# Altium project CPU_v1.PrjPCB (part 1 of 2)
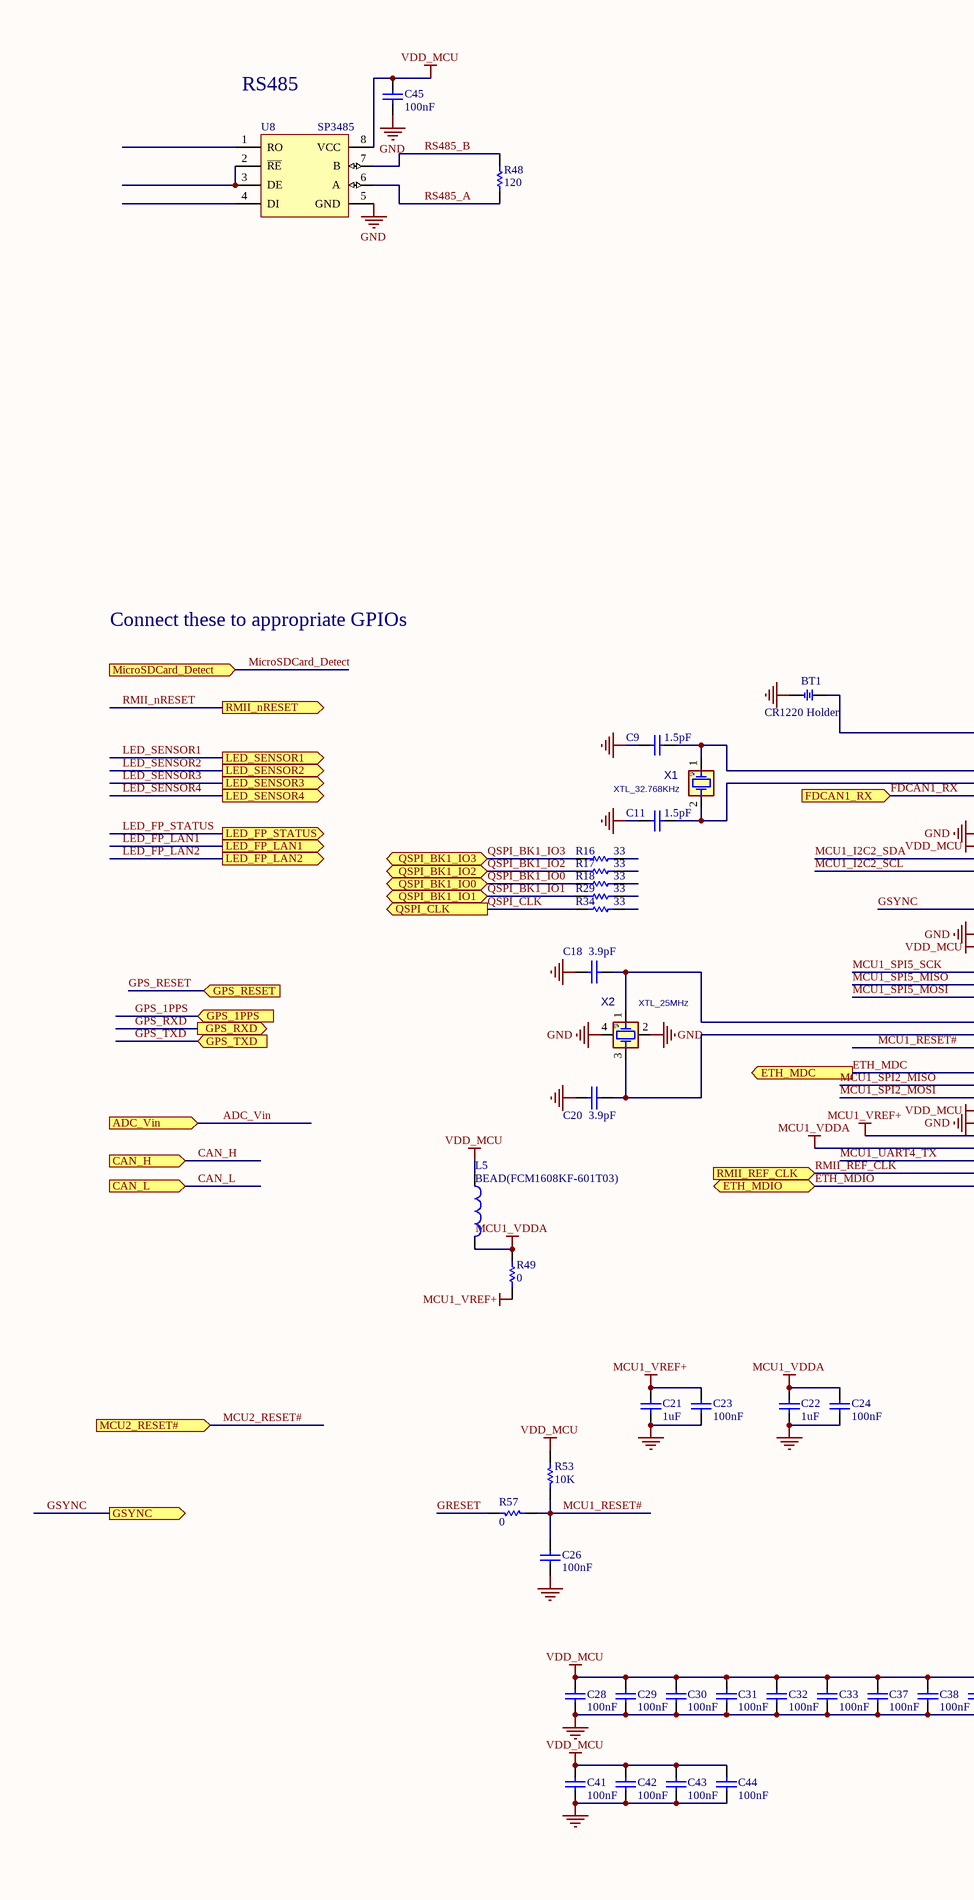
[diagram p0: MCU176_1.SchDoc, left]
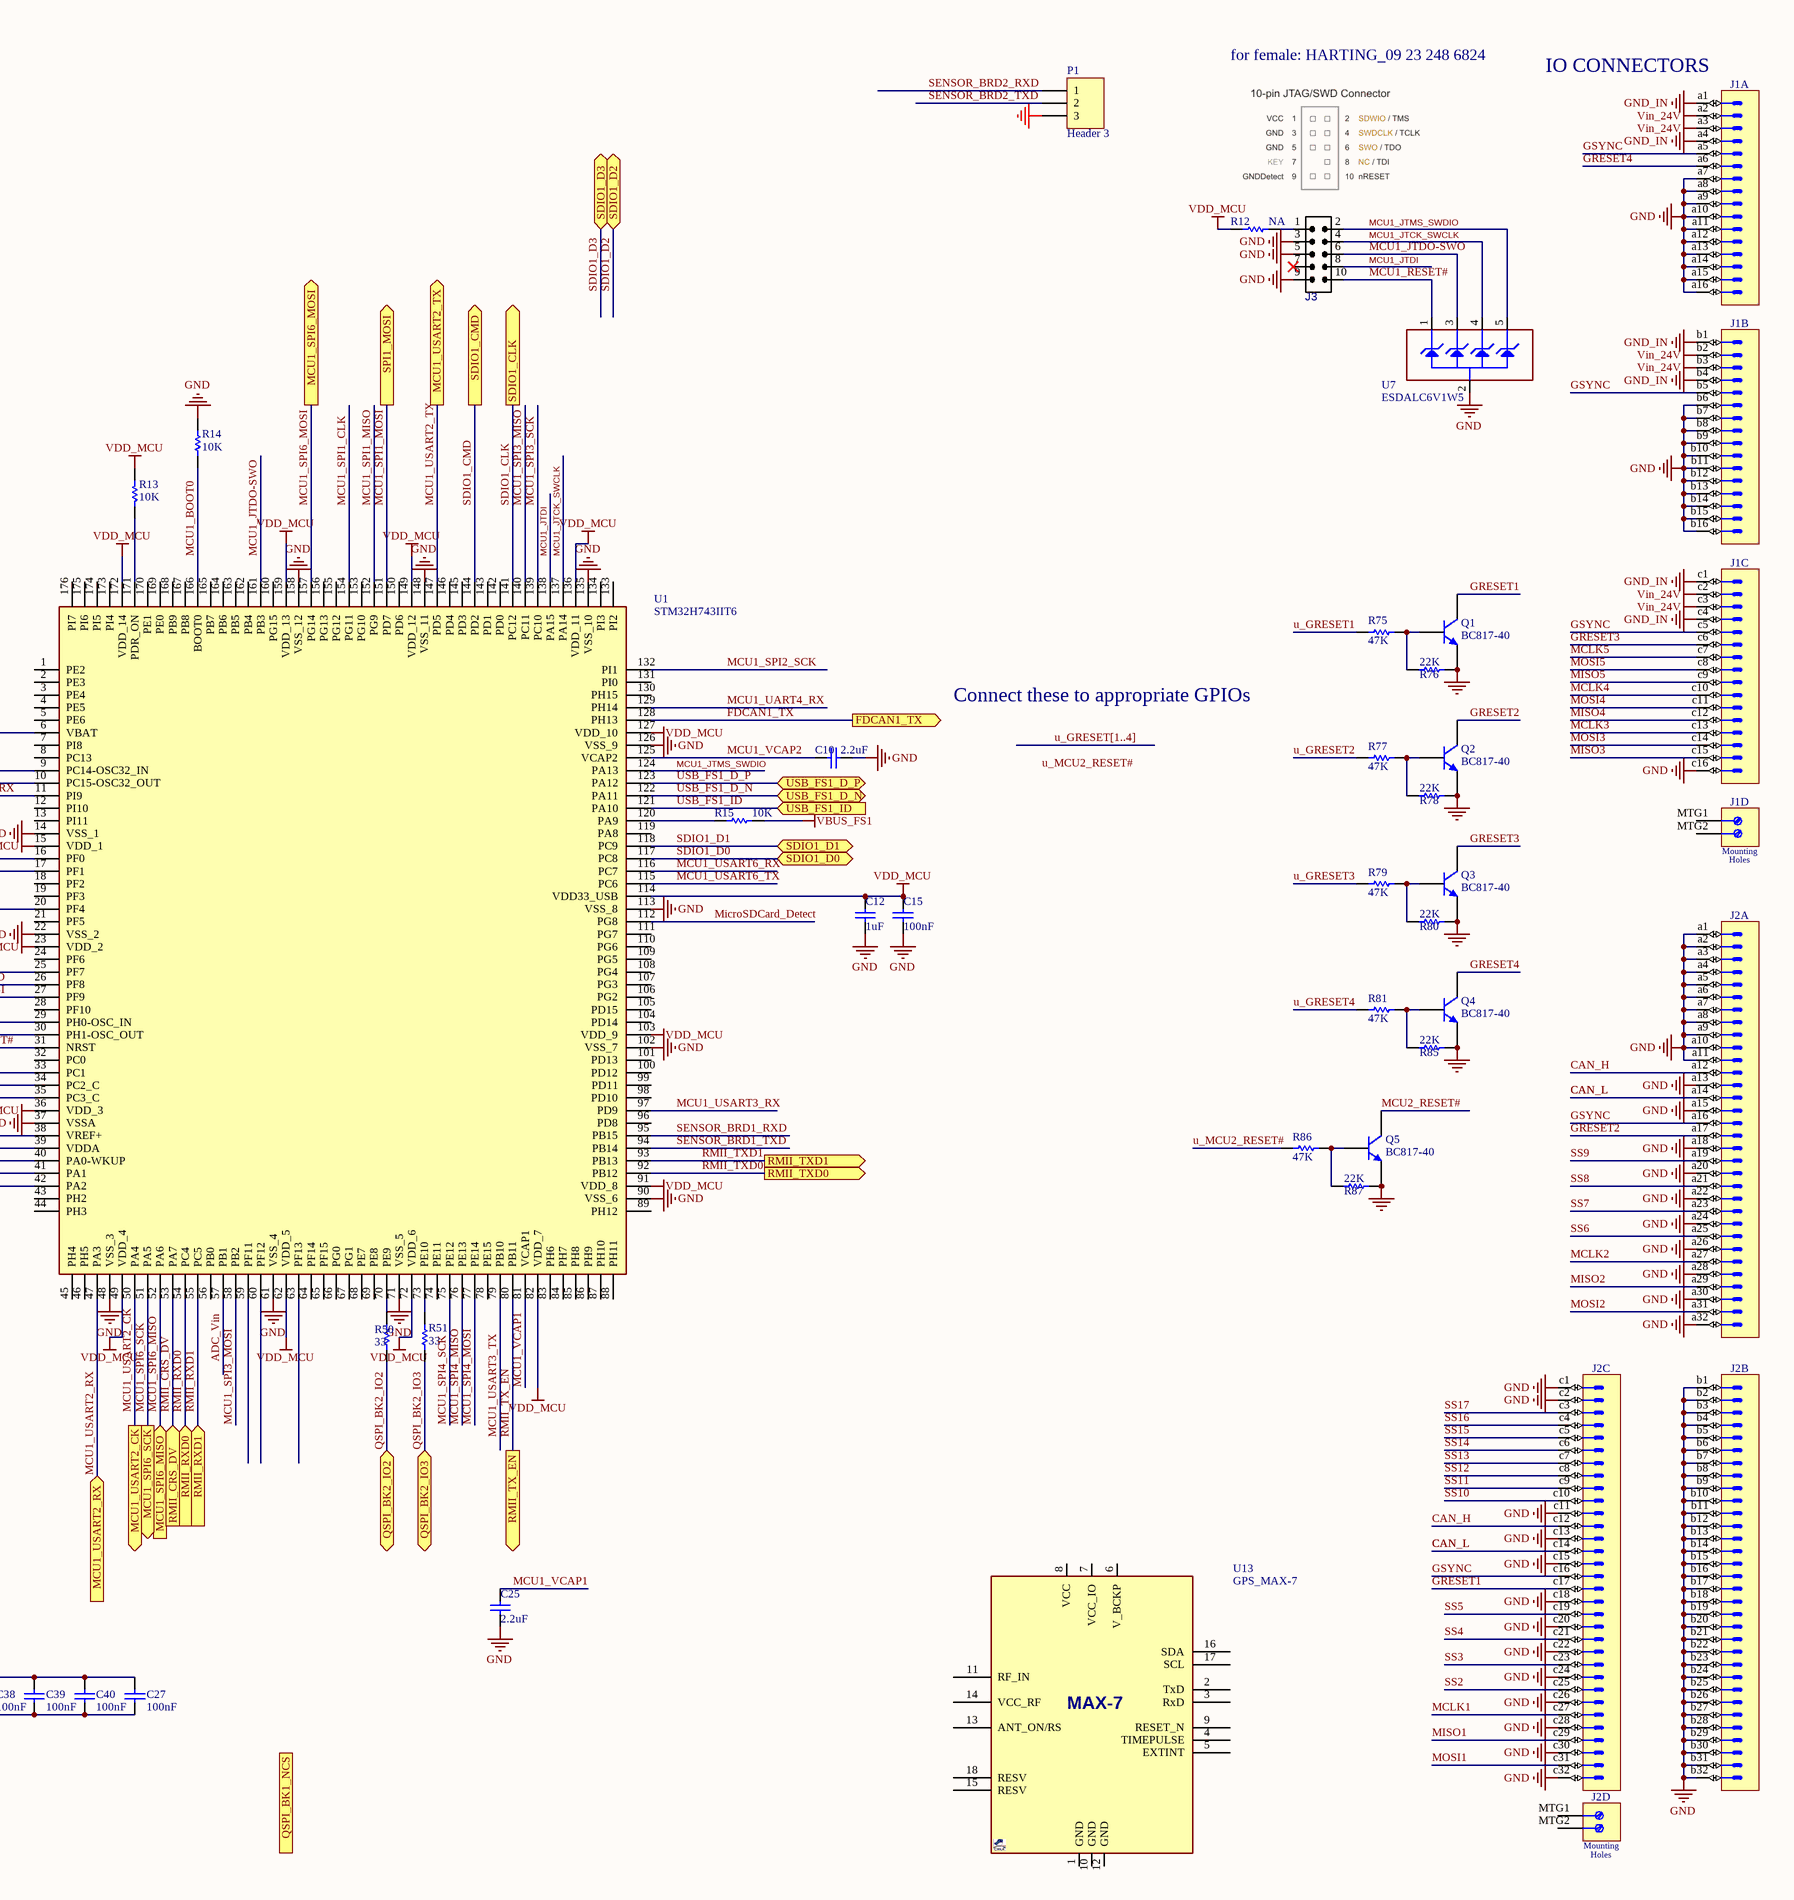
[diagram p1: MCU176_1.SchDoc, right]
11 sheets, 303 parts. Net scope: flat (ports and power ports of the same name join across sheets).
Board file: CPU_v1.PcbDoc
Sheets:
  MCU176_1.SchDoc
  MCU176_2.SchDoc
  Power.SchDoc
  Ethernet.SchDoc
  FDCAN&QSPI.SchDoc
  SD card.SchDoc
  USB_OTG_FS.SchDoc
  MCU2_USB.SchDoc
  GPS.SchDoc
  LCDTFT_FPC45P_RGB.SchDoc
  OpticDiodes+LEDs.SchDoc

## Sheet MCU176_1.SchDoc
size A2

### Parts
(Parts that share a designator on the sheet are numbered #1, #2 ... from top to bottom, then left to right.)
BT1  CR1220 Holder  [BTH1220]
C9  1.5pF  [C0603E]
C10  2.2uF  [C0603E]
C11  1.5pF  [C0603E]
C12  1uF  [C0603E]
C15  100nF  [C0603E]
C18  3.9pF  [C0603E]
C20  3.9pF  [C0603E]
C21  1uF  [C0603E]
C22  1uF  [C0603E]
C23  100nF  [C0603E]
C24  100nF  [C0603E]
C25  2.2uF  [C0603E]
C26  100nF  [C0603E]
C27  100nF  [C0603E]
C28  100nF  [C0603E]
C29  100nF  [C0603E]
C30  100nF  [C0603E]
C31  100nF  [C0603E]
C32  100nF  [C0603E]
C33  100nF  [C0603E]
C37  100nF  [C0603E]
C38  100nF  [C0603E]
C39  100nF  [C0603E]
C40  100nF  [C0603E]
C41  100nF  [C0603E]
C42  100nF  [C0603E]
C43  100nF  [C0603E]
C44  100nF  [C0603E]
C45  100nF  [C0603E]
J1#1  DIN 41612 Type 2C  [HARTING_09 23 148 6921]  (value not drawn)  (parts A,B,C,D of 4)
J2  DIN 41612 Type C  [HARTING_09 03 696 6921]  (value not drawn)  (parts A,B,C,D of 4)
J3  IDC_2X5  [IDC_2X5]  (value not drawn)
L5  BEAD(FCM1608KF-601T03)  [L0603E]
P1  Header 3  [xh-3]
Q1  BC817-40  [SOT-23-3]
Q2  BC817-40  [SOT-23-3]
Q3  BC817-40  [SOT-23-3]
Q4  BC817-40  [SOT-23-3]
Q5  BC817-40  [SOT-23-3]
R12  NA  [R0603E]
R13  10K  [R0603E]
R14  10K  [R0603E]
R15  10K  [R0603E]
R16  33  [R0603E]
R17  33  [R0603E]
R18  33  [R0603E]
R29  33  [R0603E]
R34  33  [R0603E]
R48  120  [R0603E]
R49  0  [R0603E]
R50  33  [R0603E]
R51  33  [R0603E]
R53  10K  [R0603E]
R57  0  [R0603E]
R75  47K  [R0603E]
R76  22K  [R0603E]
R77  47K  [R0603E]
R78  22K  [R0603E]
R79  47K  [R0603E]
R80  22K  [R0603E]
R81  47K  [R0603E]
R85  22K  [R0603E]
R86  47K  [R0603E]
R87  22K  [R0603E]
U1  STM32H743IIT6  [QFP50P2600X2600X160-176N]
U7  ESDALC6V1W5  [SOT65P210X110-5N]
U8  (no value)  [so8]
U13  GPS_MAX-7  [GPS_MAX]
X1  XTL_32.768KHz  [XTL_2_1610]
X2  XTL_25MHz  [XTL_4_2016]

### Ports
ADC_Vin (in), CAN_H (in), CAN_L (in), ETH_MDC (out), ETH_MDIO (bidir), FDCAN1_RX (in), FDCAN1_TX (out), GPS_1PPS (in), GPS_RESET (in), GPS_RXD (out), GPS_TXD (in), GSYNC (out), LED_FP_LAN1 (out), LED_FP_LAN2 (out), LED_FP_STATUS (out), LED_SENSOR1 (out), LED_SENSOR2 (out), LED_SENSOR3 (out), LED_SENSOR4 (out), MCU1_SPI6_MISO (in), MCU1_SPI6_MOSI (out), MCU1_SPI6_SCK (out), MCU1_USART2_CK (out), MCU1_USART2_RX (in), MCU1_USART2_TX (out), MCU2_RESET# (in), MicroSDCard_Detect (in), QSPI_BK1_IO0 (bidir), QSPI_BK1_IO1 (bidir), QSPI_BK1_IO2 (bidir), QSPI_BK1_IO3 (bidir), QSPI_BK1_NCS (out), QSPI_BK2_IO2 (bidir), QSPI_BK2_IO3 (bidir), QSPI_CLK (out), RMII_CRS_DV (in), RMII_nRESET (out), RMII_REF_CLK (in), RMII_RXD0 (in), RMII_RXD1 (in), RMII_TX_EN (out), RMII_TXD0 (out), RMII_TXD1 (out), SDIO1_CLK (out), SDIO1_CMD (out), SDIO1_D0 (bidir), SDIO1_D1 (bidir), SDIO1_D2 (bidir), SDIO1_D3 (bidir), SPI1_MOSI (out), USB_FS1_D_N (bidir), USB_FS1_D_P (bidir), USB_FS1_ID (in)

### Nets
GND: BT1.2 C9.2 C10.2 C11.2 C12.1 C15.1 C18.2 C20.2 C21.1 C22.1 C23.1 C24.1 C25.1 C26.1 C27.2 C28.2 C29.2 C30.2 C31.2 C32.2 C33.2 C37.2 C38.2 C39.2 C40.2 C41.2 C42.2 C43.2 C44.2 C45.1 J1#1.a7 J1#1.a8 J1#1.a9 J1#1.a10 J1#1.a11 J1#1.a12 J1#1.a13 J1#1.a14 J1#1.a15 J1#1.a16 J1#1.b6 J1#1.b7 J1#1.b8 J1#1.b9 J1#1.b10 J1#1.b11 J1#1.b12 J1#1.b13 J1#1.b14 J1#1.b15 J1#1.b16 J1#1.c16 J2.a1 J2.a2 J2.a3 J2.a4 J2.a5 J2.a6 J2.a7 J2.a8 J2.a9 J2.a10 J2.a11 J2.a13 J2.a15 J2.a18 J2.a20 J2.a22 J2.a24 J2.a26 J2.a28 J2.a30 J2.a32 J2.b1 J2.b2 J2.b3 J2.b4 J2.b5 J2.b6 J2.b7 J2.b8 J2.b9 J2.b10 J2.b11 J2.b12 J2.b13 J2.b14 J2.b15 J2.b16 J2.b17 J2.b18 J2.b19 J2.b20 J2.b21 J2.b22 J2.b23 J2.b24 J2.b25 J2.b26 J2.b27 J2.b28 J2.b29 J2.b30 J2.b31 J2.b32 J2.c1 J2.c2 J2.c11 J2.c13 J2.c15 J2.c18 J2.c20 J2.c22 J2.c24 J2.c26 J2.c28 J2.c30 J2.c32 J3.3 J3.5 J3.9 P1.3 Q1.2(E) Q2.2(E) Q3.2(E) Q4.2(E) Q5.2(E) R14.2 R76.1 R78.1 R80.1 R85.1 R87.1 U1.14(VSS_1) U1.22(VSS_2) U1.37(VSSA) U1.48(VSS_3) U1.61(VSS_4) U1.71(VSS_5) U1.90(VSS_6) U1.102(VSS_7) U1.113(VSS_8) U1.126(VSS_9) U1.135(VSS_10) U1.148(VSS_11) U1.158(VSS_12) U7.2(GND) U8.5(GND) X2.2(GND1) X2.4(GND2)
GND_IN: J1#1.a1 J1#1.a4 J1#1.b1 J1#1.b4 J1#1.c1 J1#1.c4
MCU1_VDDA: C22.2 C24.2 L5.2 R49.1 U1.39(VDDA)
MCU1_VREF+: C21.2 C23.2 R49.2 U1.38(VREF+)
VBUS_FS1: R15.1
VDD_MCU: C12.2 C15.2 C27.1 C28.1 C29.1 C30.1 C31.1 C32.1 C33.1 C37.1 C38.1 C39.1 C40.1 C41.1 C42.1 C43.1 C44.1 C45.2 L5.1 R12.2 R13.1 R53.1 U1.15(VDD_1) U1.23(VDD_2) U1.36(VDD_3) U1.49(VDD_4) U1.62(VDD_5) U1.72(VDD_6) U1.82(VDD_7) U1.91(VDD_8) U1.103(VDD_9) U1.114(VDD33_USB) U1.127(VDD_10) U1.136(VDD_11) U1.149(VDD_12) U1.159(VDD_13) U1.172(VDD_14) U8.8(VCC)
Vin_24V: J1#1.a2 J1#1.a3 J1#1.b2 J1#1.b3 J1#1.c2 J1#1.c3
ADC_Vin: U1.57(PB1) ; port ADC_Vin
CAN_H: J2.a12 J2.c12 ; port CAN_H
CAN_L: J2.a14 J2.c14 ; port CAN_L
ETH_MDC: U1.33(PC1) ; port ETH_MDC
ETH_MDIO: U1.42(PA2) ; port ETH_MDIO
FDCAN1_RX: U1.11(PI9) ; port FDCAN1_RX
FDCAN1_TX: U1.128(PH13) ; port FDCAN1_TX
GRESET: R57.1
GRESET1: J2.c17 Q1.3(C)
GRESET2: J2.a17 Q2.3(C)
GRESET3: J1#1.c6 Q3.3(C)
GRESET4: J1#1.a6 Q4.3(C)
GSYNC: J1#1.a5 J1#1.b5 J1#1.c5 J2.a16 J2.c16 U1.20(PF4) ; port GSYNC
MCLK1: J2.c27
MCLK2: J2.a27
MCLK3: J1#1.c13
MCLK4: J1#1.c10
MCLK5: J1#1.c7
MCU1_BOOT0: R14.1 U1.166(BOOT0)
MCU1_I2C2_SCL: U1.17(PF1)
MCU1_I2C2_SDA: U1.16(PF0)
MCU1_JTCK_SWCLK: J3.4 U1.137(PA14) U7.4(IO3)
MCU1_JTDI: J3.8 U1.138(PA15)
MCU1_JTDO-SWO: J3.6 U1.161(PB3) U7.3(IO2)
MCU1_JTMS_SWDIO: J3.2 U1.124(PA13) U7.5(IO4)
MCU1_RESET#: C26.2 J3.10 R53.2 R57.2 U1.31(NRST) U7.1(IO1)
MCU1_SPI1_CLK: U1.154(PG11)
MCU1_SPI1_MISO: U1.152(PG9)
MCU1_SPI1_MOSI: U1.151(PD7) ; port SPI1_MOSI
MCU1_SPI2_MISO: U1.34(PC2_C)
MCU1_SPI2_MOSI: U1.35(PC3_C)
MCU1_SPI2_SCK: U1.132(PI1)
MCU1_SPI3_MISO: U1.140(PC11)
MCU1_SPI3_MOSI: U1.58(PB2)
MCU1_SPI3_SCK: U1.139(PC10)
MCU1_SPI4_MISO: U1.76(PE13)
MCU1_SPI4_MOSI: U1.77(PE14)
MCU1_SPI4_SCK: U1.75(PE12)
MCU1_SPI5_MISO: U1.26(PF8)
MCU1_SPI5_MOSI: U1.27(PF9)
MCU1_SPI5_SCK: U1.25(PF7)
MCU1_SPI6_MISO: U1.52(PA6) ; port MCU1_SPI6_MISO
MCU1_SPI6_MOSI: U1.157(PG14) ; port MCU1_SPI6_MOSI
MCU1_SPI6_SCK: U1.51(PA5) ; port MCU1_SPI6_SCK
MCU1_UART4_RX: U1.129(PH14)
MCU1_UART4_TX: U1.40(PA0-WKUP)
MCU1_USART2_CK: U1.50(PA4) ; port MCU1_USART2_CK
MCU1_USART2_RX: U1.47(PA3) ; port MCU1_USART2_RX
MCU1_USART2_TX: U1.147(PD5) ; port MCU1_USART2_TX
MCU1_USART3_RX: U1.97(PD9)
MCU1_USART3_TX: U1.79(PB10)
MCU1_USART6_RX: U1.116(PC7)
MCU1_USART6_TX: U1.115(PC6)
MCU1_VCAP1: C25.2 U1.81(VCAP1)
MCU1_VCAP2: C10.1 U1.125(VCAP2)
MCU2_RESET#: Q5.3(C) ; port MCU2_RESET#
MicroSDCard_Detect: U1.112(PG8) ; port MicroSDCard_Detect
MISO1: J2.c29
MISO2: J2.a29
MISO3: J1#1.c15
MISO4: J1#1.c12
MISO5: J1#1.c9
MOSI1: J2.c31
MOSI2: J2.a31
MOSI3: J1#1.c14
MOSI4: J1#1.c11
MOSI5: J1#1.c8
QSPI_BK1_IO0: R18.2 ; port QSPI_BK1_IO0
QSPI_BK1_IO1: R29.2 ; port QSPI_BK1_IO1
QSPI_BK1_IO2: R17.2 ; port QSPI_BK1_IO2
QSPI_BK1_IO3: R16.2 ; port QSPI_BK1_IO3
QSPI_BK2_IO2: R50.2 ; port QSPI_BK2_IO2
QSPI_BK2_IO3: R51.2 ; port QSPI_BK2_IO3
QSPI_CLK: R34.2 ; port QSPI_CLK
RMII_CRS_DV: U1.53(PA7) ; port RMII_CRS_DV
RMII_REF_CLK: U1.41(PA1) ; port RMII_REF_CLK
RMII_RXD0: U1.54(PC4) ; port RMII_RXD0
RMII_RXD1: U1.55(PC5) ; port RMII_RXD1
RMII_TX_EN: U1.80(PB11) ; port RMII_TX_EN
RMII_TXD0: U1.92(PB12) ; port RMII_TXD0
RMII_TXD1: U1.93(PB13) ; port RMII_TXD1
RS485_A: R48.2 U8.6(A)
RS485_B: R48.1 U8.7(B)
SDIO1_CLK: U1.141(PC12) ; port SDIO1_CLK
SDIO1_CMD: U1.144(PD2) ; port SDIO1_CMD
SDIO1_D0: U1.117(PC8) ; port SDIO1_D0
SDIO1_D1: U1.118(PC9) ; port SDIO1_D1
SENSOR_BRD1_RXD: U1.95(PB15)
SENSOR_BRD1_TXD: U1.94(PB14)
SENSOR_BRD2_RXD: P1.1
SENSOR_BRD2_TXD: P1.2
SS2: J2.c25
SS3: J2.c23
SS4: J2.c21
SS5: J2.c19
SS6: J2.a25
SS7: J2.a23
SS8: J2.a21
SS9: J2.a19
SS10: J2.c10
SS11: J2.c9
SS12: J2.c8
SS13: J2.c7
SS14: J2.c6
SS15: J2.c5
SS16: J2.c4
SS17: J2.c3
u_GRESET1: R75.1
u_GRESET2: R77.1
u_GRESET3: R79.1
u_GRESET4: R81.1
u_MCU2_RESET#: R86.1
USB_FS1_D_N: U1.122(PA11) ; port USB_FS1_D_N
USB_FS1_D_P: U1.123(PA12) ; port USB_FS1_D_P
USB_FS1_ID: U1.121(PA10) ; port USB_FS1_ID
NetBT1_1: BT1.1 U1.6(VBAT)
NetC9_1: C9.1 U1.9(PC14-OSC32_IN) X1.1(OSC1)
NetC11_1: C11.1 U1.10(PC15-OSC32_OUT) X1.2(OSC2)
NetC18_1: C18.1 U1.29(PH0-OSC_IN) X2.1(XA)
NetC20_1: C20.1 U1.30(PH1-OSC_OUT) X2.3(XB)
NetJ3_1: J3.1 R12.1
NetQ1_1: Q1.1(B) R75.2 R76.2
NetQ2_1: Q2.1(B) R77.2 R78.2
NetQ3_1: Q3.1(B) R79.2 R80.2
NetQ4_1: Q4.1(B) R81.2 R85.2
NetQ5_1: Q5.1(B) R86.2 R87.2
NetR13_2: R13.2 U1.171(PDR_ON)
NetR15_2: R15.2 U1.120(PA9)
NetR50_1: R50.1 U1.70(PE9)
NetR51_1: R51.1 U1.73(PE10)
NetU8_2: U8.2(~{RE}) U8.3(DE)

Not connected (* = marked no-connect by the designer): J1#1 MTG1 MTG2; J2 MTG1 MTG2; J3 7*; R16 1; R17 1; R18 1; R29 1; R34 1; U1 1(PE2) 2(PE3) 3(PE4) 4(PE5) 5(PE6) 7(PI8) 8(PC13) 12(PI10) 13(PI11) 18(PF2) 19(PF3) 21(PF5) 24(PF6) 28(PF10) 32(PC0) 43(PH2) 44(PH3) 45(PH4) 46(PH5) 56(PB0) 59(PF11) 60(PF12) 63(PF13) 64(PF14) 65(PF15) 66(PG0) 67(PG1) 68(PE7) 69(PE8) 74(PE11) 78(PE15) 83(PH6) 84(PH7) 85(PH8) 86(PH9) 87(PH10) 88(PH11) 89(PH12) 96(PD8) 98(PD10) 99(PD11) 100(PD12) 101(PD13) 104(PD14) 105(PD15) 106(PG2) 107(PG3) 108(PG4) 109(PG5) 110(PG6) 111(PG7) 119(PA8) 130(PH15) 131(PI0) 133(PI2) 134(PI3) 142(PD0) 143(PD1) 145(PD3) 146(PD4) 150(PD6) 153(PG10) 155(PG12) 156(PG13) 160(PG15) 162(PB4) 163(PB5) 164(PB6) 165(PB7) 167(PB8) 168(PB9) 169(PE0) 170(PE1) 173(PI4) 174(PI5) 175(PI6) 176(PI7); U8 1(RO) 4(DI); U13 1(GND) 2(TxD) 3(RxD) 4(TIMEPULSE) 5(EXTINT) 6(V_BCKP) 7(VCC_IO) 8(VCC) 9(RESET_N) 10(GND) 11(RF_IN) 12(GND) 13(ANT_ON/RS) 14(VCC_RF) 15(RESV) 16(SDA) 17(SCL) 18(RESV)

### Buses and harness runs
bus u_GRESET[1..4]

### Notes on the sheet
- RS485
- for female: HARTING_09 23 248 6824
- IO CONNECTORS
- Connect these to appropriate GPIOs
- Labels drawn without touching a wire or pin: u_MCU2_RESET#
- (in symbol GPS_MAX-7Q) MAX-7
- (in symbol HARTING_09 03 696 6921, part D) Mounting; Holes
- (in symbol HARTING_09 23 148 6921, part D) Mounting; Holes

### Library data of the parts
BT1 = BATH_CR1220: BATTERY HOLDER, CR1220; VALUE: BAT3volt; MANF_P#: -; .: http://www.chila.ir
C9 C11 = Capacitor_ST: Capacitor 0402 / 0603 / 0805; Value: 100nF; Revision: July-2002: Re-released for DXP Platform.
C10 C12 C15 C21-C25 C45 = Cap: Capacitor; Value: 10nF; Published: 8-Jun-2000; Revision: July-2002: Re-released for DXP Platform.; Publisher: Altium Limited
C18 C20 C27-C33 C37-C44 = CAP: Capacitor
  C27-C33 C37-C44: Published: 8-Jun-2000; Revision: July-2002: Re-released for DXP Platform.; Publisher: Altium Limited; Value: 100nF
C26 = CAP: Capacitor; Value: 100pF; Published: 8-Jun-2000; Revision: July-2002: Re-released for DXP Platform.; Publisher: Altium Limited
J1#1 = HARTING_09 23 148 6921: Connector 48abc Male (3x16); Part Description: DIN 41612, Type 2C, Thru-Hole;  Rows a+b+c, 48 Position, Performance level 2, Lead 3.0mm, Pitch 2.54mm, Right Angle Male Connector; PressFit: No; Part Number: HARTING_09 23 148 6921; Component Kind: Standard; Component Type: Standard; Pin Count: 48; Family: DIN 41612 Type 2C; Mounted: Yes; Socket: No; SMD: No; Sense: No; Status: None; Manufacturer: HARTING; Manufacturer Part Number: 09 23 148 6921; ComponentHeight: 11mm; HelpURL: \\cern.ch\dfs\Applications\Altium\Datasheets\HARTING_09 23 148 6921.pdf; Author: CERN DEM JLC; CreateDate: 9/4/2012; LatestRevisionDate: 9/4/2012
J2 = HARTING_09 03 696 6921: Connector 96abc male (3x32); Part Description: DIN 41612, Type C, Thru-Hole;  Rows a+b+c, 96 Position, Performance level 2, Lead 3.0 mm, Pitch 2.54mm, Right Angle Male Connector With Coding; PressFit: No; Part Number: HARTING_09 03 696 6921; Component Kind: Standard; Component Type: Standard; Pin Count: 98; Family: DIN 41612 Type C; Mounted: Yes; Socket: No; SMD: No; Sense: No; Status: None; Manufacturer: HARTING; Manufacturer Part Number: 09 03 696 6921; ComponentHeight: 13.1mm; HelpURL: \\cern.ch\dfs\Applications\Altium\Datasheets\HARTING_09 03 696 6921.pdf; Author: CERN DEM JLC; CreateDate: 3/30/2011; LatestRevisionDate: 3/30/2011
J3 = IDC_2X5: CONN, IDC, Male, pitch: 2.54mm, 10POS; VALUE: IDC_2X5
L5 = Inductor: Value: 100uH; Published: 8-Jun-2000; Revision: July-2002: Re-released for DXP Platform.; Publisher: Altium Limited
P1 = Header 3: Header, 3-Pin; LatestRevisionDate: 17-Jul-2002; LatestRevisionNote: Re-released for DXP Platform.; Publisher: Altium Limited
Q1-Q5 = BC817-40: TRANS NPN 300V 0.3A SOT23; Manufacturer: Micro Commercial Co; Manufacturer Part Number: MMBTA42-TP; Current Footprint: TO-236-3, SC-59, SOT-23-3; PCB Name: GS-101; Board Qty: 1000; ITEM/NO: 71; Vce Saturation (Max) @ Ib, Ic: 500mV @ 2mA, 20mA; DC Current Gain (hFE) (Min) @ Ic, Vce: 40 @ 30mA, 10V; Frequency - Transition: 50MHz; Current - Collector Cutoff (Max): 100nA (ICBO); HelpURL: D:\HNA\Datasheet Documents\MMBTA42(SOT-23).pdf; Part Number: BC817-40; Size / Dimension: NULL; Supplier: Digi-Key; Mounting Type: Surface Mount; Base Part Number: MMBTA42; Supplier Device Package: SOT-23; Part Status: Active; RoHS: RoHS Compliant; Category: Discrete Semiconductor Products; Supplier Part Number: MMBTA42TPMSCT-ND; Operating Temperature: -55°C ~ 150°C (TJ); Package / Case: TO-236-3, SC-59, SOT-23-3; Transistor Type: NPN; Packaging: Cut Tape (CT); Pricing: 1=0.22, 10=0.203, 25=0.146, 100=0.1136, 250=0.07136, 500=0.06084, 1000=0.04137 (USD); Stock: 49544
R12 R13 R15-R18 R29 R34 R48-R51 R53 R57 = Res1: Resistor; Value: 1K; Published: 8-Jun-2000; Revision: July-2002: Re-released for DXP Platform.; Publisher: Altium Limited
R14 R75-R81 R85-R87 = res1: Resistor; Value: 1K; Published: 8-Jun-2000; Revision: July-2002: Re-released for DXP Platform.; Publisher: Altium Limited
U1 = STM32H743IIT6: Integrated Circuit; Manufacturer_Name: STMicroelectronics; Datasheet Link: https://componentsearchengine.com/Datasheets/1/STM32H743IIT6.pdf; Height: 1.6mm; Manufacturer_Part_Number: STM32H743IIT6; Mouser Part Number: 511-STM32H743IIT6; Mouser Price/Stock: https://www.mouser.co.uk/ProductDetail/STMicroelectronics/STM32H743IIT6?qs=FNcb6ahWXRzE163cq8Rfjg%3D%3D; Arrow Part Number: STM32H743IIT6; Arrow Price/Stock: https://www.arrow.com/en/products/stm32h743iit6/stmicroelectronics?region=nac
U7 = ESDALC6V1W5: Dual Transil array for ESD protection; Manuf_1: STM; Manuf_Part_1: ESDA5V3L; Ref St: 9179034; Provided: ST; ECCN_US/EU: EAR99/NEC; Distrib: ST; Order: ESDA5V3L; Ordered by: STM
U8 = SP3485: IC TXRX RS485 HALF DUPLEX 8SOIC; Manufacturer: Exar Corporation; Manufacturer Part Number: SP3485CN-L; Current Footprint: 8-SOIC (0.154", 3.90mm Width); Board Qty: 100; PCB Name: Main_PCB; Mounting Type: Surface Mount; Package / Case: 8-SOIC (0.154", 3.90mm Width); ComponentLink1URL: http://www.exar.com/Common/Content/Document.ashx?id=639; ComponentLink1Description: http://www.exar.com/Common/Content/Document.ashx?id=639; Part Number: SP3485; Pricing: 1=2.24, 10=2.027, 100=1.6292, 250=1.4482, 500=1.26716, 1000=0.937 (USD); Size / Dimension: NULL; Supplier: Digi-Key; Supplier Part Number: 1016-1144-5-ND; HelpURL: D:\HNA\Datasheet Documents\SP3485_100_061912.pdf
U13 = GPS_MAX-7Q: GPS Module, UART/I2C, GPS/QZSS, GLONASS; MANF: U-BLOX; MANF_P#: MAX-7Q; PARAM2: 2.7~3.6V, Lowest power; VALUE: GPS_MAX-7
X1 = XTL_2_32.768_3215A: Crystal; MANF_P#: ABS05-32.768KHZ-9-T; PARAM2: 7pF, 20PPM; PARAM: -40~85oC; MANF: -; PRICE: 1$; VALUE: XTL_32.768KHz
X2 = XTL_4_25MHz_3225: CRYSTAL; PARAM: 10PPM; DESC: DESCRIPTION; DIST#: MOUSER; PARAM2: PARAM; MANF_P#: XRCGB25M000F1H00R0; MANF: -; ASSEMBLY: ASSEMBLY; PRICE: 0.5$; VALUE: XTL_25MHz

## Sheet MCU176_2.SchDoc
size A2
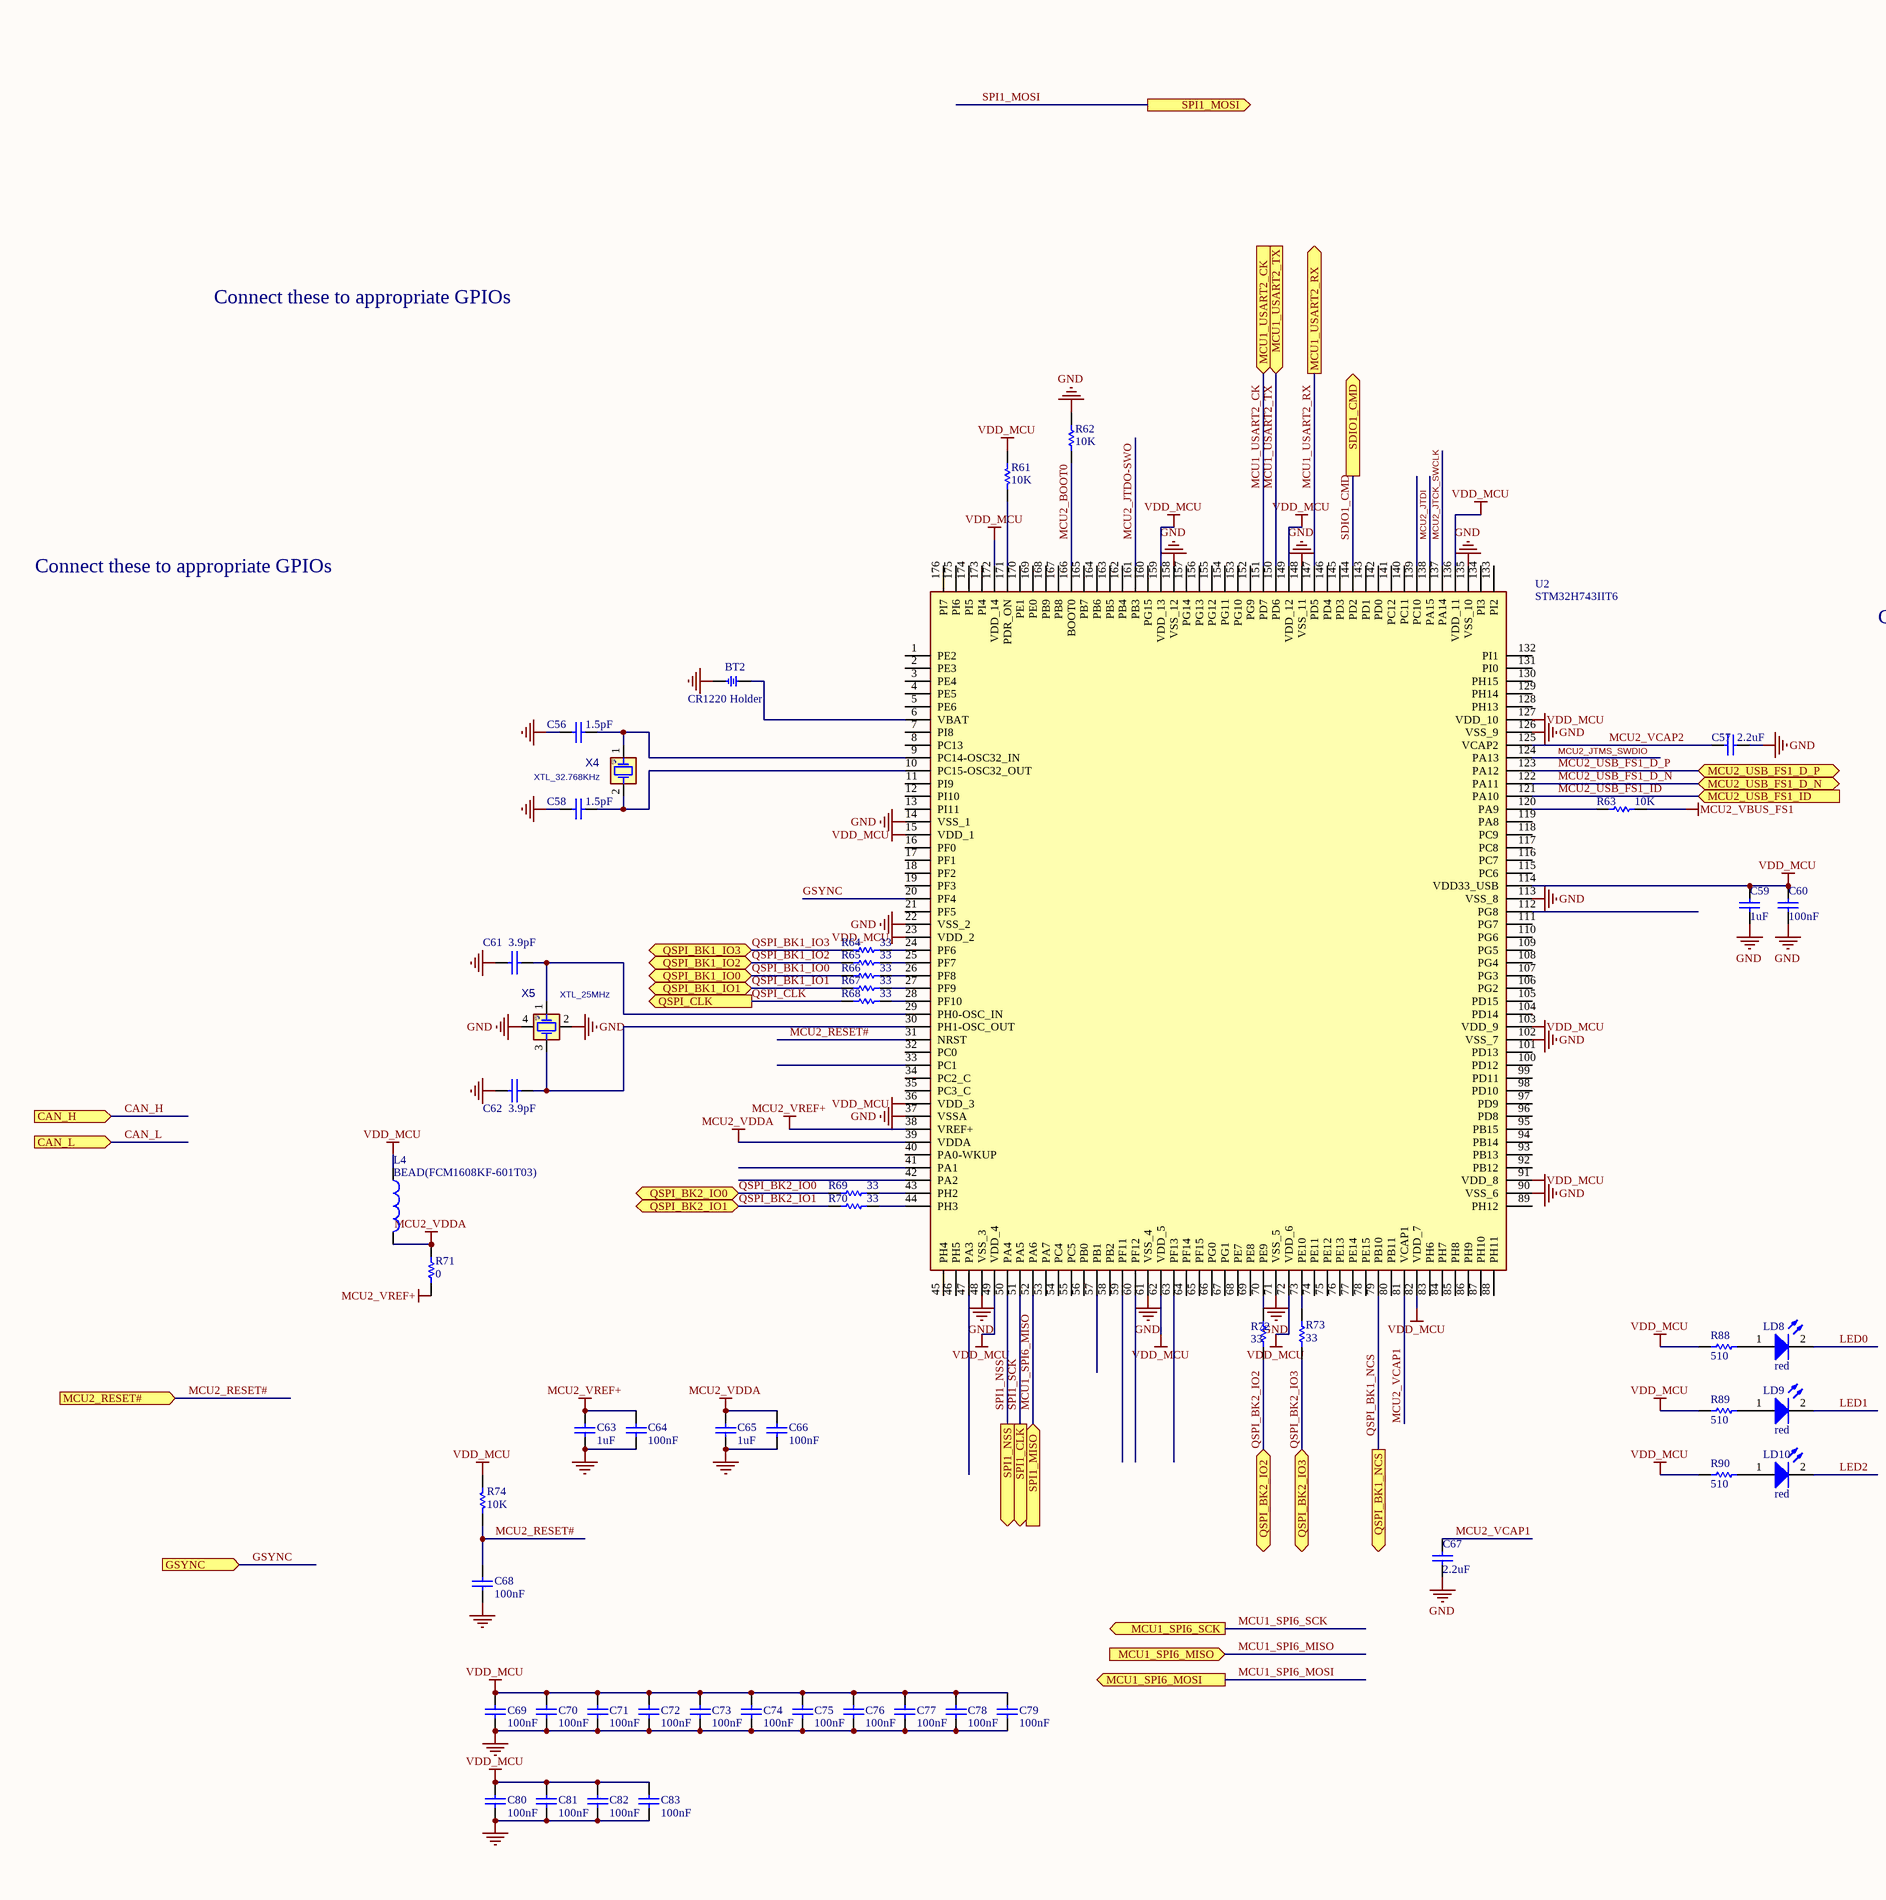
[diagram p2: MCU176_2.SchDoc, left]
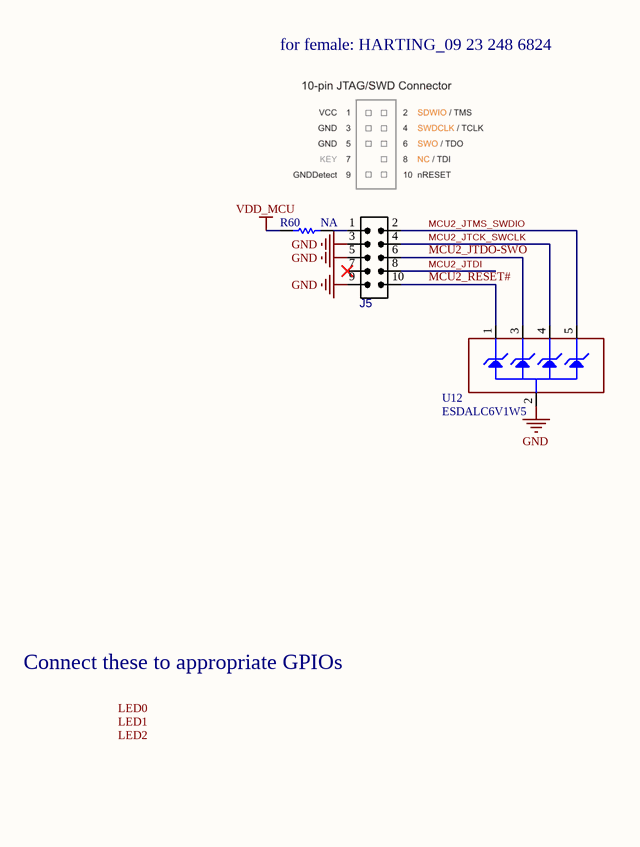
[diagram p3: MCU176_2.SchDoc, right]

### Parts
BT2  CR1220 Holder  [BTH1220]
C56  1.5pF  [C0603E]
C57  2.2uF  [C0603E]
C58  1.5pF  [C0603E]
C59  1uF  [C0603E]
C60  100nF  [C0603E]
C61  3.9pF  [C0603E]
C62  3.9pF  [C0603E]
C63  1uF  [C0603E]
C64  100nF  [C0603E]
C65  1uF  [C0603E]
C66  100nF  [C0603E]
C67  2.2uF  [C0603E]
C68  100nF  [C0603E]
C69  100nF  [C0603E]
C70  100nF  [C0603E]
C71  100nF  [C0603E]
C72  100nF  [C0603E]
C73  100nF  [C0603E]
C74  100nF  [C0603E]
C75  100nF  [C0603E]
C76  100nF  [C0603E]
C77  100nF  [C0603E]
C78  100nF  [C0603E]
C79  100nF  [C0603E]
C80  100nF  [C0603E]
C81  100nF  [C0603E]
C82  100nF  [C0603E]
C83  100nF  [C0603E]
J5  IDC_2X5  [IDC_2X5]  (value not drawn)
L4  BEAD(FCM1608KF-601T03)  [L0603E]
LD8  red  [LED0603GRN]
LD9  red  [LED0603GRN]
LD10  red  [LED0603GRN]
R60  NA  [R0603E]
R61  10K  [R0603E]
R62  10K  [R0603E]
R63  10K  [R0603E]
R64  33  [R0603E]
R65  33  [R0603E]
R66  33  [R0603E]
R67  33  [R0603E]
R68  33  [R0603E]
R69  33  [R0603E]
R70  33  [R0603E]
R71  0  [R0603E]
R72  33  [R0603E]
R73  33  [R0603E]
R74  10K  [R0603E]
R88  510  [R0603E]
R89  510  [R0603E]
R90  510  [R0603E]
U2  STM32H743IIT6  [QFP50P2600X2600X160-176N]
U12  ESDALC6V1W5  [SOT65P210X110-5N]
X4  XTL_32.768KHz  [XTL_2_1610]
X5  XTL_25MHz  [XTL_4_2016]

### Ports
CAN_H (in), CAN_L (in), GSYNC (in), MCU1_SPI6_MISO (in), MCU1_SPI6_MOSI (out), MCU1_SPI6_SCK (out), MCU1_USART2_CK (in), MCU1_USART2_RX (out), MCU1_USART2_TX (in), MCU2_RESET# (in), MCU2_USB_FS1_D_N (bidir), MCU2_USB_FS1_D_P (bidir), MCU2_USB_FS1_ID (in), QSPI_BK1_IO0 (bidir), QSPI_BK1_IO1 (bidir), QSPI_BK1_IO2 (bidir), QSPI_BK1_IO3 (bidir), QSPI_BK1_NCS (out), QSPI_BK2_IO0 (bidir), QSPI_BK2_IO1 (bidir), QSPI_BK2_IO2 (bidir), QSPI_BK2_IO3 (bidir), QSPI_CLK (out), SDIO1_CMD (out), SPI1_CLK (out), SPI1_MISO (in), SPI1_MOSI (out), SPI1_NSS (out)

### Nets
GND: BT2.2 C56.2 C57.2 C58.2 C59.1 C60.1 C61.2 C62.2 C63.1 C64.1 C65.1 C66.1 C67.1 C68.1 C69.2 C70.2 C71.2 C72.2 C73.2 C74.2 C75.2 C76.2 C77.2 C78.2 C79.2 C80.2 C81.2 C82.2 C83.2 J5.3 J5.5 J5.9 R62.2 U2.14(VSS_1) U2.22(VSS_2) U2.37(VSSA) U2.48(VSS_3) U2.61(VSS_4) U2.71(VSS_5) U2.90(VSS_6) U2.102(VSS_7) U2.113(VSS_8) U2.126(VSS_9) U2.135(VSS_10) U2.148(VSS_11) U2.158(VSS_12) U12.2(GND) X5.2(GND1) X5.4(GND2)
MCU2_VBUS_FS1: R63.1
MCU2_VDDA: C65.2 C66.2 L4.2 R71.1 U2.39(VDDA)
MCU2_VREF+: C63.2 C64.2 R71.2 U2.38(VREF+)
VDD_MCU: C59.2 C60.2 C69.1 C70.1 C71.1 C72.1 C73.1 C74.1 C75.1 C76.1 C77.1 C78.1 C79.1 C80.1 C81.1 C82.1 C83.1 L4.1 R60.2 R61.1 R74.1 R88.2 R89.2 R90.2 U2.15(VDD_1) U2.23(VDD_2) U2.36(VDD_3) U2.49(VDD_4) U2.62(VDD_5) U2.72(VDD_6) U2.82(VDD_7) U2.91(VDD_8) U2.103(VDD_9) U2.114(VDD33_USB) U2.127(VDD_10) U2.136(VDD_11) U2.149(VDD_12) U2.159(VDD_13) U2.172(VDD_14)
GSYNC: U2.20(PF4) ; port GSYNC
LED0: LD8.2(K)
LED1: LD9.2(K)
LED2: LD10.2(K)
MCU1_SPI6_MISO: U2.52(PA6) ; port SPI1_MISO, port MCU1_SPI6_MISO
MCU1_USART2_CK: U2.151(PD7) ; port MCU1_USART2_CK
MCU1_USART2_RX: U2.147(PD5) ; port MCU1_USART2_RX
MCU1_USART2_TX: U2.150(PD6) ; port MCU1_USART2_TX
MCU2_BOOT0: R62.1 U2.166(BOOT0)
MCU2_JTCK_SWCLK: J5.4 U2.137(PA14) U12.4(IO3)
MCU2_JTDI: J5.8 U2.138(PA15)
MCU2_JTDO-SWO: J5.6 U2.161(PB3) U12.3(IO2)
MCU2_JTMS_SWDIO: J5.2 U2.124(PA13) U12.5(IO4)
MCU2_RESET#: C68.2 J5.10 R74.2 U2.31(NRST) U12.1(IO1) ; port MCU2_RESET#
MCU2_USB_FS1_D_N: U2.122(PA11) ; port MCU2_USB_FS1_D_N
MCU2_USB_FS1_D_P: U2.123(PA12) ; port MCU2_USB_FS1_D_P
MCU2_USB_FS1_ID: U2.121(PA10) ; port MCU2_USB_FS1_ID
MCU2_VCAP1: C67.2 U2.81(VCAP1)
MCU2_VCAP2: C57.1 U2.125(VCAP2)
QSPI_BK1_IO0: R66.2 ; port QSPI_BK1_IO0
QSPI_BK1_IO1: R67.2 ; port QSPI_BK1_IO1
QSPI_BK1_IO2: R65.2 ; port QSPI_BK1_IO2
QSPI_BK1_IO3: R64.2 ; port QSPI_BK1_IO3
QSPI_BK1_NCS: U2.79(PB10) ; port QSPI_BK1_NCS
QSPI_BK2_IO0: R69.2 ; port QSPI_BK2_IO0
QSPI_BK2_IO1: R70.2 ; port QSPI_BK2_IO1
QSPI_BK2_IO2: R72.2 ; port QSPI_BK2_IO2
QSPI_BK2_IO3: R73.2 ; port QSPI_BK2_IO3
QSPI_CLK: R68.2 ; port QSPI_CLK
SDIO1_CMD: U2.144(PD2) ; port SDIO1_CMD
SPI1_NSS: U2.50(PA4) ; port SPI1_NSS
SPI1_SCK: U2.51(PA5) ; port SPI1_CLK
NetBT2_1: BT2.1 U2.6(VBAT)
NetC56_1: C56.1 U2.9(PC14-OSC32_IN) X4.1(OSC1)
NetC58_1: C58.1 U2.10(PC15-OSC32_OUT) X4.2(OSC2)
NetC61_1: C61.1 U2.29(PH0-OSC_IN) X5.1(XA)
NetC62_1: C62.1 U2.30(PH1-OSC_OUT) X5.3(XB)
NetJ5_1: J5.1 R60.1
NetLD8_1: LD8.1(A) R88.1
NetLD9_1: LD9.1(A) R89.1
NetLD10_1: LD10.1(A) R90.1
NetR61_2: R61.2 U2.171(PDR_ON)
NetR63_2: R63.2 U2.120(PA9)
NetR64_1: R64.1 U2.24(PF6)
NetR65_1: R65.1 U2.25(PF7)
NetR66_1: R66.1 U2.26(PF8)
NetR67_1: R67.1 U2.27(PF9)
NetR68_1: R68.1 U2.28(PF10)
NetR69_1: R69.1 U2.43(PH2)
NetR70_1: R70.1 U2.44(PH3)
NetR72_1: R72.1 U2.70(PE9)
NetR73_1: R73.1 U2.73(PE10)

Not connected (* = marked no-connect by the designer): J5 7*; U2 1(PE2) 2(PE3) 3(PE4) 4(PE5) 5(PE6) 7(PI8) 8(PC13) 11(PI9) 12(PI10) 13(PI11) 16(PF0) 17(PF1) 18(PF2) 19(PF3) 21(PF5) 32(PC0) 33(PC1) 34(PC2_C) 35(PC3_C) 40(PA0-WKUP) 41(PA1) 42(PA2) 45(PH4) 46(PH5) 47(PA3) 53(PA7) 54(PC4) 55(PC5) 56(PB0) 57(PB1) 58(PB2) 59(PF11) 60(PF12) 63(PF13) 64(PF14) 65(PF15) 66(PG0) 67(PG1) 68(PE7) 69(PE8) 74(PE11) 75(PE12) 76(PE13) 77(PE14) 78(PE15) 80(PB11) 83(PH6) 84(PH7) 85(PH8) 86(PH9) 87(PH10) 88(PH11) 89(PH12) 92(PB12) 93(PB13) 94(PB14) 95(PB15) 96(PD8) 97(PD9) 98(PD10) 99(PD11) 100(PD12) 101(PD13) 104(PD14) 105(PD15) 106(PG2) 107(PG3) 108(PG4) 109(PG5) 110(PG6) 111(PG7) 112(PG8) 115(PC6) 116(PC7) 117(PC8) 118(PC9) 119(PA8) 128(PH13) 129(PH14) 130(PH15) 131(PI0) 132(PI1) 133(PI2) 134(PI3) 139(PC10) 140(PC11) 141(PC12) 142(PD0) 143(PD1) 145(PD3) 146(PD4) 152(PG9) 153(PG10) 154(PG11) 155(PG12) 156(PG13) 157(PG14) 160(PG15) 162(PB4) 163(PB5) 164(PB6) 165(PB7) 167(PB8) 168(PB9) 169(PE0) 170(PE1) 173(PI4) 174(PI5) 175(PI6) 176(PI7)

### Notes on the sheet
- for female: HARTING_09 23 248 6824
- Connect these to appropriate GPIOs
- Labels drawn without touching a wire or pin: LED0, LED1, LED2

### Library data of the parts
BT2 = BATH_CR1220: BATTERY HOLDER, CR1220; VALUE: BAT3volt; MANF_P#: -; .: http://www.chila.ir
C56 C58 = Capacitor_ST: as C9 on sheet MCU176_1; Revision: July-2002: Re-released for DXP Platform.
C57 C59 C60 C63-C67 = Cap: Capacitor; Value: 10nF; Published: 8-Jun-2000; Revision: July-2002: Re-released for DXP Platform.; Publisher: Altium Limited
C61 C62 C69-C83 = CAP: Capacitor
  C69-C83: Published: 8-Jun-2000; Revision: July-2002: Re-released for DXP Platform.; Publisher: Altium Limited; Value: 100nF
C68 = CAP: Capacitor; Value: 100pF; Published: 8-Jun-2000; Revision: July-2002: Re-released for DXP Platform.; Publisher: Altium Limited
J5 = IDC_2X5: CONN, IDC, Male, pitch: 2.54mm, 10POS; VALUE: IDC_2X5
L4 = Inductor: Value: 100uH; Published: 8-Jun-2000; Revision: July-2002: Re-released for DXP Platform.; Publisher: Altium Limited
LD8-LD10 = LED2: Typical RED, GREEN, YELLOW, AMBER GaAs LED; Published: 8-Jun-2000; Revision: July-2002: Re-released for DXP Platform.; Publisher: Altium Limited
R60 R61 R63-R74 = Res1: Resistor; Value: 1K; Published: 8-Jun-2000; Revision: July-2002: Re-released for DXP Platform.; Publisher: Altium Limited
R62 R88-R90 = res1: Resistor; Value: 1K; Published: 8-Jun-2000; Revision: July-2002: Re-released for DXP Platform.; Publisher: Altium Limited
U2 = STM32H743IIT6: as U1 on sheet MCU176_1; Datasheet Link: https://componentsearchengine.com/Datasheets/1/STM32H743IIT6.pdf; Height: 1.6mm; Manufacturer_Part_Number: STM32H743IIT6; Mouser Part Number: 511-STM32H743IIT6; Mouser Price/Stock: https://www.mouser.co.uk/ProductDetail/STMicroelectronics/STM32H743IIT6?qs=FNcb6ahWXRzE163cq8Rfjg%3D%3D; Arrow Part Number: STM32H743IIT6; Arrow Price/Stock: https://www.arrow.com/en/products/stm32h743iit6/stmicroelectronics?region=nac
U12 = ESDALC6V1W5: as U7 on sheet MCU176_1; Distrib: ST; Order: ESDA5V3L; Ordered by: STM
X4 = XTL_2_32.768_3215A: as X1 on sheet MCU176_1; MANF: -; PRICE: 1$; VALUE: XTL_32.768KHz
X5 = XTL_4_25MHz_3225: as X2 on sheet MCU176_1; MANF: -; ASSEMBLY: ASSEMBLY; PRICE: 0.5$; VALUE: XTL_25MHz

## Sheet Power.SchDoc: Power
size A4; DocumentNumber: MB1246; Revision: B.1; SheetNumber: 3; SheetTotal: 17; Project: STM32H7xxI-EVAL
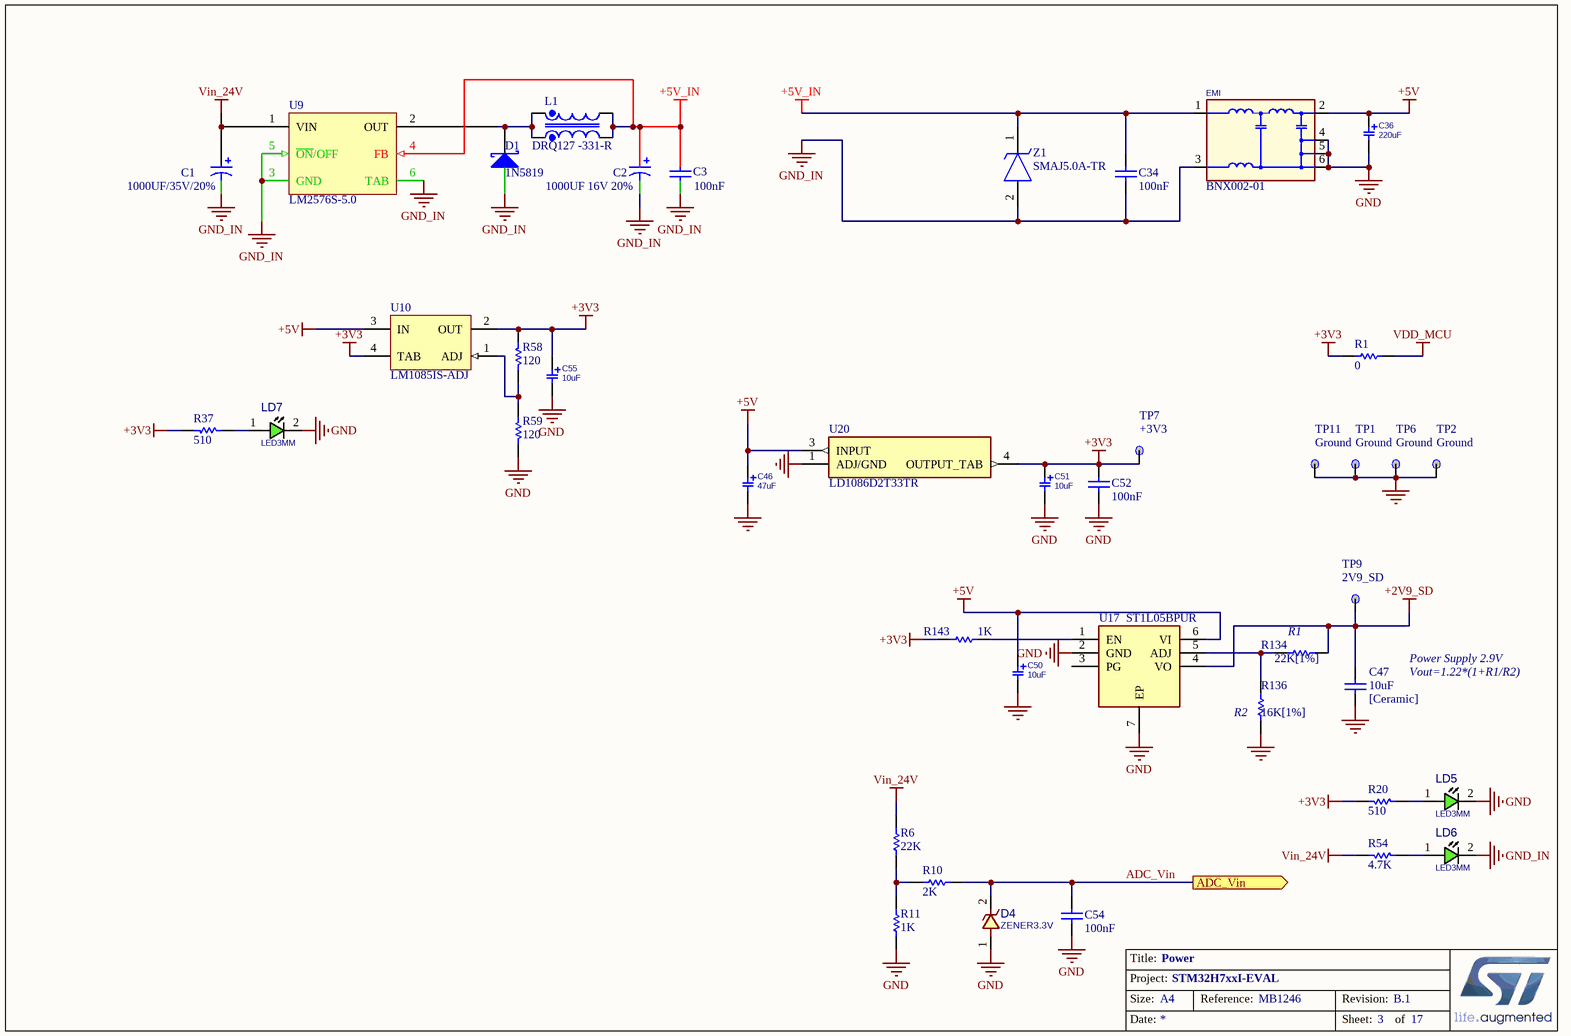
[diagram p4: Power.SchDoc]

### Parts
(Parts that share a designator on the sheet are numbered #1, #2 ... from top to bottom, then left to right.)
C1#1  1000UF/35V/20%  [RB.2/.4]
C2#1  1000UF 16V 20%  [RB.2/.4]
C3#1  100nF  [C0603E]
C34  100nF  [C0603E]
C36  220uF  [C_TN_7343]
C46  47uF  [C_TN_3528]
C47  10uF  [C0603E]
C50  10uF  [C_TN_3216]
C51  10uF  [C_TN_3216]
C52  100nF  [C0603E]
C54  100nF  [C0603E]
C55  10uF  [C_TN_3528]
D1  1N5819  [DO-41]
D4  ZENER3.3V  [D_SOD523]
EMI  BNX002-01  [BNX002]
L1  DRQ127 -331-R  [Inductor DRQ127Series]
LD5  LED3MM  [LED3MM]
LD6  LED3MM  [LED3MM]
LD7  LED3MM  [LED3MM]
R1#1  0  [R1206E]
R6#1  22K  [R0603E]
R10  2K  [R0603E]
R11  1K  [R0603E]
R20  510  [R0603E]
R37  510  [R0603E]
R54  4.7K  [R0603E]
R58  120  [R0603E]
R59  120  [R0603E]
R134  22K[1%]  [R0603E]
R136  16K[1%]  [R0603E]
R143  1K  [R0603E]
TP1  Ground  [TP]
TP2  Ground  [TP]
TP6  Ground  [TP]
TP7  +3V3  [TP]
TP9  2V9_SD  [TP]
TP11  Ground  [TP]
U9  LM2576S-5.0  [TO-263-5]
U10  LM1085IS-ADJ  [TS3B_N]
U17  ST1L05BPUR  [SON95P300X300X100-7N-D]
U20  LD1086D2T33TR  [TO254P1542X460-3N]
Z1  SMAJ5.0A-TR  [SM4T82AY]

### Ports
ADC_Vin (out)

### Nets
+2V9_SD: C47.1 R134.1 TP9.1 U17.4(VO)
+3V3: C51.1 C52.1 C55.1 R1#1.2 R20.1 R37.1 R58.1 R143.2 TP7.1 U10.2(OUT) U10.4(TAB) U20.4(OUTPUT_TAB)
+5V: C36.1 C46.1 C50.1 EMI.2(CB) U10.3(IN) U17.6(VI) U20.3(INPUT)
+5V_IN: C2#1.1 C3#1.2 C34.1 EMI.1(B) L1.3 L1.4 U9.4(FB) Z1.1(K)
GND: C36.2 C46.2 C47.2 C50.2 C51.2 C52.2 C54.2 C55.2 D4.1 EMI.4(CG1) EMI.5(CG2) EMI.6(CG3) LD5.2(CATHODE) LD7.2(CATHODE) R11.2 R59.2 R136.2 TP1.1 TP2.1 TP6.1 TP11.1 U17.2(GND) U17.7(EP) U20.1(ADJ/GND)
GND_IN: C1#1.2 C2#1.2 C3#1.1 C34.2 D1.1(A) EMI.3(PSG) LD6.2(CATHODE) U9.3(GND) U9.5(~{ON}/OFF) U9.6(TAB) Z1.2(A)
VDD_MCU: R1#1.1
Vin_24V: C1#1.1 R6#1.1 R54.1 U9.1(VIN)
ADC_Vin: C54.1 D4.2 R10.2 ; port ADC_Vin
NetD1_2: D1.2(K) L1.1 L1.2 U9.2(OUT)
NetLD5_1: LD5.1(ANODE) R20.2
NetLD6_1: LD6.1(ANODE) R54.2
NetLD7_1: LD7.1(ANODE) R37.2
NetR6#1_2: R6#1.2 R10.1 R11.1
NetR58_2: R58.2 R59.1 U10.1(ADJ)
NetR134_2: R134.2 R136.1 U17.5(ADJ)
NetR143_1: R143.1 U17.1(EN)

Not connected (* = marked no-connect by the designer): U17 3(PG)

### Notes on the sheet
- (near R134) R1
- (near R136) R2
- (near C47) [Ceramic]
- Power Supply 2.9V
- Vout=1.22*(1+R1/R2)
- Title:
- Project:
- Size:
- Date:
- A4
- Reference:
- Sheet:
- Revision:
- of

### Library data of the parts
C1#1 = Cap Pol1: Polarized Aluminum Electrolytic Capacitor (Radial) , Lead Spacing :5.00mm  Diameter : 10.00mm   Height - Seated (Max) : 21.50mm; Manufacturer: Rubycon; Assembly Status: A; Published: 8-Jun-2000; LatestRevisionDate: 17-Jul-2002; LatestRevisionNote: Re-released for DXP Platform.; PackageReference: RB7.6-15; Publisher: Altium Limited; Value: 1000UF/35V/20%; Current Footprint: RB.2/.4
C2#1 = Cap Pol1: Polarized Aluminum Electrolytic Capacitor (Radial) , Lead Spacing :5.00mm  Diameter : 10.00mm   Height - Seated (Max) : 16mm; Assembly Status: A; Published: 8-Jun-2000; LatestRevisionDate: 17-Jul-2002; LatestRevisionNote: Re-released for DXP Platform.; PackageReference: RB7.6-15; Publisher: Altium Limited; Value: 1000UF 16V 20%; Manufacturer: *; Current Footprint: RB.2/.4
C3#1 = Cap: Ceramic Capacitor; Manufacturer: Vishay or Panasonic; Current Footprint: 0805 (2012 Metric); Assembly Status: A; Published: 8-Jun-2000; LatestRevisionDate: 17-Jul-2002; LatestRevisionNote: Re-released for DXP Platform.; PackageReference: RAD-0.3; Publisher: Altium Limited; Value: 100nF
C34 = CAP: Capacitor; Value: 100pF; Published: 8-Jun-2000; Revision: July-2002: Re-released for DXP Platform.; Publisher: Altium Limited
C36 = CAP_SMD_TAN_220uF: CAP, SMD, TAN; PARAM: 20%, 35mOhm, -55~105oC; MANF: VISHAY; MANF_P#: T55D227M6R3C0035; PARAM2: 6.3V; PRICE: 1.9$; VALUE: 220uF
C46 C55 = CAP_SMD_TAN_10uF_16V: CAP, SMD, TAN; PARAM: 20%, 200mOhm, -55~105oC; MANF: AVX; MANF_P#: TCJT106M016R0200; PARAM2: 16V; PRICE: 1$
  C46: VALUE: 47uF
  C55: VALUE: 10uF
C47 C52 C54 = Cap: Capacitor; Value: 10nF; Published: 8-Jun-2000; Revision: July-2002: Re-released for DXP Platform.; Publisher: Altium Limited
C50 C51 = CAP_SMD_TAN_10uF_6.3V: CAP, SMD, TAN; PARAM: 20%, 300mOhm, -55~105oC; MANF: VISHAY; MANF_P#: T55A106M6R3C0300; PARAM2: 6.3V; PRICE: 0.46$; VALUE: 10uF
D1 = D Schottky: DIODE SCHOTTKY 40V 1A DO41; Manufacturer: Fairchild Semiconductor; Assembly Status: A; Published: 8-Jun-2000; LatestRevisionDate: 17-Jul-2002; LatestRevisionNote: Re-released for DXP Platform.; PackageReference: SMB; Publisher: Altium Limited; Code_JEDEC: DO-214-AA; Current Footprint: DO-41
D4 = DIODE_SMD_ZENER_MM5Z12V: DIODE, ZENER, 0.2W, 3.3V; MANF: Fairchild; DESC: DESCRIPTION; PARAM: 12V; ASSEMBLY: ASSEMBLY; PRICE: PRICE; PARAM2: 0.2W; MANF_P#: MM5Z12V; VALUE: ZENER3.3V
EMI = BNX002-01: EMIFIL, BLOCK TYPE,; MANF: MURATA; MANF_P#: BNX002-01; VALUE: BNX002-01
L1 = DRQ127 -331-R: Manufacturer: Eaton Bussmann; Part Picture: E:\Projects\Electrinic Part Pictures\DRQ127-331-R.bmp; PCB Project: FL3 Controller; Assembly Status: A; Board Qty: 300; Current Footprint: TO-263; Description1: INDUCT ARRAY 2 COIL 323.6UH SMD; in stock Qty: 0; Repository Qty: 55; Manufacturer Part Number: DRQ127-331-R; Mounting Type: Surface Mount; Package / Case: Nonstandard; Size / Dimension: 0.492" L x 0.492" W (12.50mm x 12.50mm); ComponentLink1URL: E:\DataSheet1\Coil\DRQ127-331-R.pdf; ComponentLink1Description: Datasheet; HelpURL: E:\DataSheet1\Coil\DRQ127-331-R.pdf; Main Supplier: Ocean Electronic (Int'L) Limited--(http://www.iic-ic.com); PackageDescription: Nonstandard; Part Number: DRQ127-331-R; Pricing: 350=1.35, 700=1.275, 1050=1.1625, 3500=1.125, 8750=1.0875, 17500=1.05, 35000=0.9975 (USD); SHOP NAME: ?; Supplier: Digi-Key; Supplier Device Package: Nonstandard; Supplier Part Number: 513-1317-2-ND
LD5-LD7 = LED_THD_3MM: LED, THD, 3MM, GREEN; DESC: DESCRIPTION; MANF_P#: MANF_PART#; PARAM2: 2.2V; MANF: MANF; ASSEMBLY: ASSEMBLY; PRICE: PRICE; VALUE: LED3MM
R1#1 R6#1 R10 = res1: Resistor; Value: 1K; Published: 8-Jun-2000; Revision: July-2002: Re-released for DXP Platform.; Publisher: Altium Limited
R11 R143 = res1: Resistor; Published: 8-Jun-2000; Revision: July-2002: Re-released for DXP Platform.; Publisher: Altium Limited; Value: 1K
R20 R37 R54 R58 R59 = Res1: Resistor: thick film; SMD; Manufacturer: Vishay or Panasonic; Manufacturer Part Number: NULL; Board Qty: 1000; Current Footprint: 0603 (1608 Metric); Value: 4.7KR; PCB Name: GS-101; ITEM/NO: 15; ComponentLink1Description: Datasheet; ComponentLink1URL: D:\HNA\Datasheet Documents\Resistor-Chip-UniOhm.pdf; Description1: Resistor: thick film; SMD; HelpURL: D:\HNA\Datasheet Documents\Resistor-Chip-UniOhm.pdf; Mounting Type: Surface Mount, MLCC; Package / Case: 0603 (1608 Metric); Pricing: NULL; Supplier: NULL; Supplier Part Number: NULL; Size / Dimension: NULL
  R20 R37: Part Number: 510
  R54: Part Number: 4.7K
  R58 R59: Part Number: 120
R134 R136 = Res1: Resistor; Value: 1K; Published: 8-Jun-2000; Revision: July-2002: Re-released for DXP Platform.; Publisher: Altium Limited
TP1 TP2 TP6 TP7 TP9 TP11 = TP
U9 = LM2575S-5.0: SIMPLE SWITCHER® 1A Step-Down Voltage Regulator, 5-pin TO-263; Manufacturer: National Semiconductor; Manufacturer: SEMTECH; PackageTopMarking: NSUZXYTTE#*LM2575S*-5.0 P+; PowerWise: N; Assembly Status: A; Published: 4-Dec-2008; DatasheetVersion: Apr-2007; PackageVersion: revD, Apr-2005; PackageReference: TS5B; Publisher: Altium Limited; PackageDescription: TO-263, Molded, .400 x .390 x .180in, 5 Lead, .067in Pitch, Surface Mount; Supplier 1: Farnell; Supplier Part Number 1: 1523849; Supplier 2: Farnell; Supplier Part Number 2: 9489860; PartNumber: LM2575S-5.0; RoHS: N; PinCount: 5; CompType: Switcher; Code_JEDEC: MO-169-AB; ComponentLink1Description: LM2575 Datasheet; ComponentLink1URL: http://www.national.com/ds/LM/LM2575.pdf; ComponentLink2Description: LM2575 Web Page; ComponentLink2URL: http://www.national.com/pf/LM/LM2575.html; ComponentLink3Description: TS5B Package Page; ComponentLink3URL: http://www.national.com/packaging/folders/ts5b.html; Current Footprint: TO-263-5; Price: 0.23$
U10 = LM1085IS-ADJ: 3A Low Dropout Positive Regulators, 3-pin TO-263; Manufacturer: National Semiconductor; PackageTopMarking: NSUZXYTTE#*LM1085*IS-ADJ; PowerWise: N; CompType: LDO IC; High-Reliability: Y; DatasheetVersion: Jun-2005; PackageVersion: revF, Apr-2005; PackageReference: TS3B; PackageDescription: TO-263, Molded, .400 x .390 x .180in, 3 Lead, .1in Pitch, Surface Mount; PartNumber: LM1085IS-ADJ; RoHS: N; PinCount: 3; Code_JEDEC: MO-169-AA; ComponentLink1Description: Manufacturer URL; ComponentLink1URL: http://www.national.com/; ComponentLink2Description: LM1085 Datasheet; ComponentLink2URL: http://www.national.com/ds/LM/LM1085.pdf; ComponentLink3Description: LM1085 Web Page; ComponentLink3URL: http://www.national.com/pf/LM/LM1085.html; ComponentLink4Description: TS3B Package Page; ComponentLink4URL: http://www.national.com/packaging/folders/ts3b.html
U17 = ST1L05BPUR: Integrated Circuit; Manufacturer_Name: STMicroelectronics; Datasheet Link: https://www.st.com/resource/en/datasheet/st1l05.pdf; Height: 1mm; Manufacturer_Part_Number: ST1L05BPUR; Mouser Part Number: 511-ST1L05BPUR; Mouser Price/Stock: https://www.mouser.co.uk/ProductDetail/STMicroelectronics/ST1L05BPUR?qs=MJw%2F449BOx8r6LrCfzDi%2FA%3D%3D; Arrow Part Number: ST1L05BPUR; Arrow Price/Stock: https://www.arrow.com/en/products/st1l05bpur/stmicroelectronics
U20 = LD1086D2T33TR: Integrated Circuit; Manufacturer_Name: STMicroelectronics; Datasheet Link: http://www.st.com/web/en/resource/technical/document/datasheet/CD00001884.pdf; Height: 4.6mm; Manufacturer_Part_Number: LD1086D2T33TR; Mouser Part Number: 511-LD1086D2T33-TR; Mouser Price/Stock: https://www.mouser.co.uk/ProductDetail/STMicroelectronics/LD1086D2T33TR?qs=NVtqiPcHxP%2FqlwvBP9ORAw%3D%3D; Arrow Part Number: LD1086D2T33TR; Arrow Price/Stock: https://www.arrow.com/en/products/ld1086d2t33tr/stmicroelectronics?region=europe
Z1 = SMAJ5.0A-TR: TVS Diode (Uni-directional); Manufacturer_Name: STMicroelectronics; Datasheet Link: https://www.st.com/resource/en/datasheet/smaj10ca.pdf; Height: 2.65mm; Manufacturer_Part_Number: SMAJ5.0A-TR; Mouser Part Number: 511-SMAJ5.0A; Mouser Price/Stock: https://www.mouser.co.uk/ProductDetail/STMicroelectronics/SMAJ5.0A-TR?qs=yuSVFimk%2FuaGVxy2BbsCxA%3D%3D; Arrow Part Number: SMAJ5.0A-TR; Arrow Price/Stock: https://www.arrow.com/en/products/smaj5.0a-tr/stmicroelectronics?region=nac

## Sheet Ethernet.SchDoc: Ethernet
size A3; DocumentNumber: MB1246; Revision: B.1; SheetNumber: 7; SheetTotal: 17; Project: STM32H7xxI-EVAL
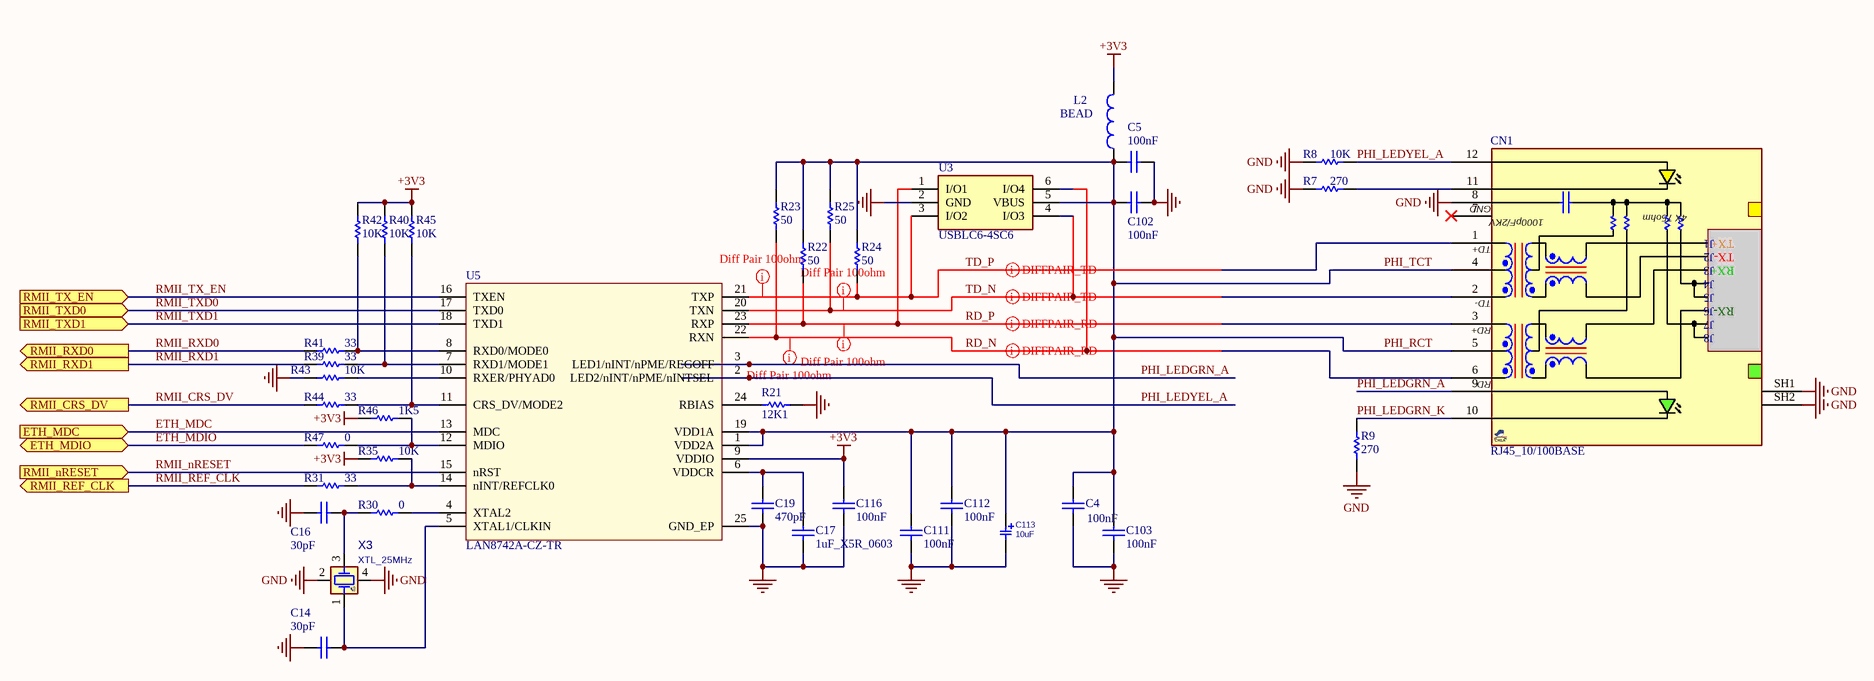
[diagram p5: Ethernet.SchDoc]

### Parts
(Parts that share a designator on the sheet are numbered #1, #2 ... from top to bottom, then left to right.)
C4#1  100nF  [C0603E]
C5#1  100nF  [C0603E]
C14  30pF  [C0603E]
C16  30pF  [C0603E]
C17  1uF_X5R_0603  [C0603E]
C19  470pF  [C0603E]
C102  100nF  [C0603E]
C103  100nF  [C0603E]
C111  100nF  [C0603E]
C112  100nF  [C0603E]
C113  10uF  [C_TN_3216]
C116  100nF  [C0603E]
CN1  RJ45_10/100BASE  [RJ45_8M_HR911105A]
L2  BEAD  [L0603E]
R7#1  270  [R0603E]
R8#1  10K  [R0603E]
R9#1  270  [R0603E]
R21  12K1  [R0603E]
R22  50  [R0603E]
R23  50  [R0603E]
R24  50  [R0603E]
R25  50  [R0603E]
R30  0  [R0603E]
R31  33  [R0603E]
R35  10K  [R0603E]
R39  33  [R0603E]
R40  10K  [R0603E]
R41  33  [R0603E]
R42  10K  [R0603E]
R43  10K  [R0603E]
R44  33  [R0603E]
R45  10K  [R0603E]
R46  1K5  [R0603E]
R47  0  [R0603E]
U3  USBLC6-4SC6  [SOT95P280X145-6N]
U5  LAN8742A-CZ-TR  [QFN50P400X400X100-25N-D]
X3  XTL_25MHz  [XTL_4_3225]

### Ports
ETH_MDC (in), ETH_MDIO (bidir), RMII_CRS_DV (out), RMII_nRESET (in), RMII_REF_CLK (out), RMII_RXD0 (out), RMII_RXD1 (out), RMII_TX_EN (in), RMII_TXD0 (in), RMII_TXD1 (in)

### Nets
+3V3: C116.2 L2.2 R35.1 R40.1 R42.1 R45.1 R46.2 U5.9(VDDIO)
GND: C4#1.1 C5#1.1 C14.2 C16.2 C17.2 C19.1 C102.1 C103.1 C111.1 C112.1 C113.2 C116.1 CN1.8(CHSGND) CN1.SH1 CN1.SH2 R7#1.1 R8#1.1 R9#1.2 R21.2 R43.2 U3.2(GND) U5.25(GND_EP) X3.2(GND1) X3.4(GND2)
ETH_MDC: U5.13(MDC) ; port ETH_MDC
ETH_MDIO: R47.2 ; port ETH_MDIO
PHI_LEDGRN_A: CN1.9(GLED+) U5.3(LED1/nINT/nPME/REGOFF)
PHI_LEDGRN_K: CN1.10(GLED-) R9#1.1
PHI_LEDYEL_A: CN1.12(YLED+) R8#1.2 U5.2(LED2/nINT/nPME/nINTSEL)
PHI_RCT: C4#1.2 C5#1.2 C102.2 C103.2 C111.2 C112.2 C113.1 CN1.4(TCT) CN1.5(RCT) L2.1 R22.2 R23.2 R24.2 R25.2 U3.5(VBUS) U5.1(VDD2A) U5.19(VDD1A)  [also labelled PHI_TCT]
RD_N: CN1.6(RD-) R23.1 U3.6(I/O4) U5.22(RXN)
RD_P: CN1.3(RD+) R22.1 U3.1(I/O1) U5.23(RXP)
RMII_CRS_DV: R44.2 ; port RMII_CRS_DV
RMII_nRESET: U5.15(nRST) ; port RMII_nRESET
RMII_REF_CLK: R31.2 ; port RMII_REF_CLK
RMII_RXD0: R41.2 ; port RMII_RXD0
RMII_RXD1: R39.2 ; port RMII_RXD1
RMII_TX_EN: U5.16(TXEN) ; port RMII_TX_EN
RMII_TXD0: U5.17(TXD0) ; port RMII_TXD0
RMII_TXD1: U5.18(TXD1) ; port RMII_TXD1
TD_N: CN1.2(TD-) R25.1 U3.4(I/O3) U5.20(TXN)
TD_P: CN1.1(TD+) R24.1 U3.3(I/O2) U5.21(TXP)
NetC14_1: C14.1 U5.5(XTAL1/CLKIN) X3.1(XA)
NetC16_1: C16.1 R30.2 X3.3(XB)
NetC17_1: C17.1 C19.2 U5.6(VDDCR)
NetCN1_11: CN1.11(YLED-) R7#1.2
NetR21_1: R21.1 U5.24(RBIAS)
NetR30_1: R30.1 U5.4(XTAL2)
NetR31_1: R31.1 R35.2 U5.14(nINT/REFCLK0)
NetR39_1: R39.1 R40.2 U5.7(RXD1/MODE1)
NetR41_1: R41.1 R42.2 U5.8(RXD0/MODE0)
NetR43_1: R43.1 U5.10(RXER/PHYAD0)
NetR44_1: R44.1 R45.2 U5.11(CRS_DV/MODE2)
NetR46_1: R46.1 R47.1 U5.12(MDIO)

Not connected (* = marked no-connect by the designer): CN1 7(NC)*

### Layout directives
differential pair: RD_N, RD_P, TD_N, TD_P
rule Matched Net Lengths [Tolerance = 100mil]: RD_N, RD_P, TD_N, TD_P

### Notes on the sheet
- Title:
- Project:
- Size:
- Date:
- A4
- Reference:
- Sheet:
- Revision:
- of
- (in symbol RJ45_HR911105A) GND; 4X 75ohm; 1000pF/2KV; J1; TX+; J2; TX-; J3; RX+; J4; J5; J6; RX-; J7; J8

### Library data of the parts
C4#1 C5#1 C102 C103 C111 C112 C116 = Capacitor_ST: Capacitor 0402 / 0603 / 0805; Revision: July-2002: Re-released for DXP Platform.; Value: 100nF
C14 C16 C19 = Capacitor_ST: as C9 on sheet MCU176_1; Revision: July-2002: Re-released for DXP Platform.
C17 = CAP SMD 0603  X5R 1µF 25V 10%: 0603  X5R 1µF; Rated voltage: 25V; Tolerance: 10%; Manufacturer: *; Manufacturer P/N: *; Order code Farnell: 1288202RL; Value: 1µF; Power: *; Technology: X5R; Temperature  Factor: *; Temperature Max: +125°C; Temperature Min: -55°C; STS Code: *
C113 = CAP_SMD_TAN_10uF_6.3V: as C50 on sheet Power; PRICE: 0.46$; VALUE: 10uF
CN1 = RJ45_HR911105A: RJ45, 10/100BASE, G/Y LED; MANF: Hanrun; MANF_P#: HR911105A; PARAM2: 10/100BASE, G/Y LED; VALUE: RJ45_10/100BASE
L2 = Inductor: Value: 100uH; Published: 8-Jun-2000; Revision: July-2002: Re-released for DXP Platform.; Publisher: Altium Limited
R7#1 R9#1 = Resistor_ST: Resistor 0402 / 0603 / 0805; Value: 10K
R8#1 R35 R40 R42 R43 R45 = Resistor_ST: Resistor 0402 / 0603 / 0805; Value: 10K
R21 = Res_12K1_1%_0603: Resistor,12K1,0603,1%,VISHAY; Manuf_Part_1: MCT 0603-50 1% P5 12K1; Order: 2325243; Value: 12K1; ECCN_US/EU: n/a; Manuf_1: VISHAY; Distrib: FARNELL
R22-R25 = Res_50_1%_0603: Resistor,50,0603,1%,YAGEO; Manuf_Part_1: RC0402FR-0750RL; Value: 50; Manuf_1: YAGEO; Order: *; ECCN_US/EU: n/a; Distrib: FARNELL
R30 R47 = Res1: Resistor; Value: 1K; Published: 8-Jun-2000; Revision: July-2002: Re-released for DXP Platform.; Publisher: Altium Limited
R31 R39 R41 R44 = Res_33_1%_0402: Resistor,33,0402,1%,YAGEO; Manuf_Part_1: RC0402FR-0733RL; Value: 33; Manuf_1: YAGEO; Order: *; ECCN_US/EU: n/a; Distrib: FARNELL
R46 = Res_1K5_1%_0402: Resistor,1K5,0402,1%,YAGEO; Manuf_Part_1: RC0402FR-071K5L; Value: 1K5; Manuf_1: YAGEO; Order: RC0402FR-071K5L; ECCN_US/EU: n/a; Distrib: FARNELL
U3 = USBLC6-4SC6: Integrated Circuit; Manufacturer_Name: STMicroelectronics; Datasheet Link: http://www.st.com/st-web-ui/static/active/en/resource/technical/document/datasheet/CD00047494.pdf; Height: 1.45mm; Manufacturer_Part_Number: USBLC6-4SC6; Mouser Part Number: 511-USBLC6-4SC6; Mouser Price/Stock: https://www.mouser.co.uk/ProductDetail/STMicroelectronics/USBLC6-4SC6?qs=k9dH%2Fx4GHJCNdehb8zInZg%3D%3D; Arrow Part Number: USBLC6-4SC6; Arrow Price/Stock: https://www.arrow.com/en/products/usblc6-4sc6/stmicroelectronics?region=europe
U5 = LAN8742A-CZ-TR: LAN8742A-CZ-TR - Small Footprint RMII 10/100 Ethernet, Transceiver with HP Auto-MDIX and flexPWR Technology SQFN-24; Manuf_1: MICROCHIP; Order: LAN8742A-CZ-TR; Manuf_Part_1: LAN8742A-CZ-TR; Distrib: MICROCHIP
X3 = XTL_4_25MHz_3225: CRYSTAL 25.00 MHZ 18pF, 10PPM; MANF: EPSON; DESC: DESCRIPTION; DIST#: MOUSER; PARAM2: PARAM; MANF_P#: TSX-3225 25.0000MF10P-C3; ASSEMBLY: ASSEMBLY; PARAM: 10PPM; PRICE: 0.5$; VALUE: XTL_25MHz

## Sheet FDCAN&QSPI.SchDoc: FDCAN & QSPI
size A4; DocumentNumber: MB1246; Revision: B.1; SheetNumber: 11; SheetTotal: 17; Project: STM32H7xxI-EVAL
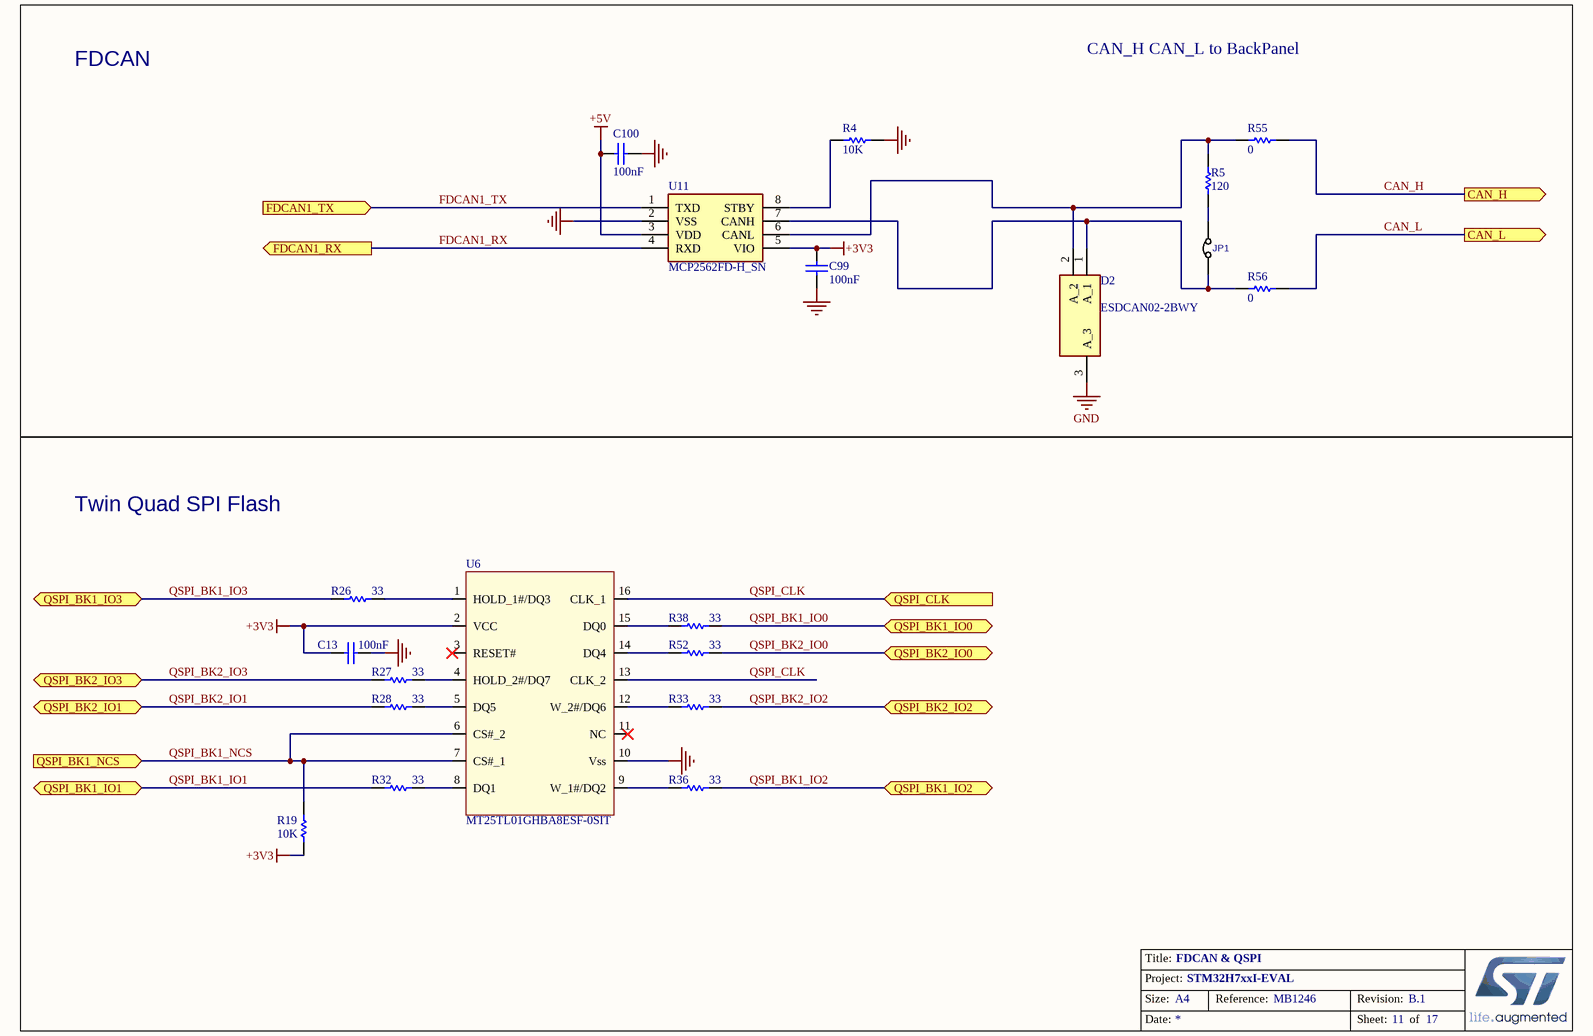
[diagram p6: FDCAN&QSPI.SchDoc]

### Parts
(Parts that share a designator on the sheet are numbered #1, #2 ... from top to bottom, then left to right.)
C13  100nF  [C0603E]
C99  100nF  [C0603E]
C100  100nF  [C0603E]
D2  ESDCAN02-2BWY  [SOT65P210X110-3N]
JP1  JMPSOLDER  [HDR1X2]  (value not drawn)
R4#1  10K  [R0603E]
R5#1  120  [R0603E]
R19  10K  [R0603E]
R26  33  [R0603E]
R27  33  [R0603E]
R28  33  [R0603E]
R32  33  [R0603E]
R33  33  [R0603E]
R36  33  [R0603E]
R38  33  [R0603E]
R52  33  [R0603E]
R55  0  [R0603E]
R56  0  [R0603E]
U6  MT25TL01GHBA8ESF-0SIT  [SOIC127P1032X265-16N]
U11  MCP2562FD-H_SN  [SOIC127P600X175-8N]

### Ports
CAN_H (out), CAN_L (out), FDCAN1_RX (out), FDCAN1_TX (in), QSPI_BK1_IO0 (bidir), QSPI_BK1_IO1 (bidir), QSPI_BK1_IO2 (bidir), QSPI_BK1_IO3 (bidir), QSPI_BK1_NCS (in), QSPI_BK2_IO0 (bidir), QSPI_BK2_IO1 (bidir), QSPI_BK2_IO2 (bidir), QSPI_BK2_IO3 (bidir), QSPI_CLK (in)

### Nets
+3V3: C13.1 C99.1 R19.2 U6.2(VCC) U11.5(VIO)
+5V: C100.1 U11.3(VDD)
GND: C13.2 C99.2 C100.2 D2.3(A_3) R4#1.2 U6.10(Vss) U11.2(VSS)
CAN_H: R55.1 ; port CAN_H
CAN_L: R56.1 ; port CAN_L
FDCAN1_RX: U11.4(RXD) ; port FDCAN1_RX
FDCAN1_TX: U11.1(TXD) ; port FDCAN1_TX
QSPI_BK1_IO0: R38.1 ; port QSPI_BK1_IO0
QSPI_BK1_IO1: R32.2 ; port QSPI_BK1_IO1
QSPI_BK1_IO2: R36.1 ; port QSPI_BK1_IO2
QSPI_BK1_IO3: R26.2 ; port QSPI_BK1_IO3
QSPI_BK1_NCS: R19.1 U6.6(CS#_2) U6.7(CS#_1) ; port QSPI_BK1_NCS
QSPI_BK2_IO0: R52.1 ; port QSPI_BK2_IO0
QSPI_BK2_IO1: R28.2 ; port QSPI_BK2_IO1
QSPI_BK2_IO2: R33.1 ; port QSPI_BK2_IO2
QSPI_BK2_IO3: R27.2 ; port QSPI_BK2_IO3
QSPI_CLK: U6.13(CLK_2) U6.16(CLK_1) ; port QSPI_CLK
NetD2_1: D2.1(A_1) JP1.1 R56.2 U11.7(CANH)
NetD2_2: D2.2(A_2) R5#1.2 R55.2 U11.6(CANL)
NetJP1_2: JP1.2 R5#1.1
NetR4#1_1: R4#1.1 U11.8(STBY)
NetR26_1: R26.1 U6.1(HOLD_1#/DQ3)
NetR27_1: R27.1 U6.4(HOLD_2#/DQ7)
NetR28_1: R28.1 U6.5(DQ5)
NetR32_1: R32.1 U6.8(DQ1)
NetR33_2: R33.2 U6.12(W_2#/DQ6)
NetR36_2: R36.2 U6.9(W_1#/DQ2)
NetR38_2: R38.2 U6.15(DQ0)
NetR52_2: R52.2 U6.14(DQ4)

Not connected (* = marked no-connect by the designer): U6 3(RESET#)* 11(NC)*

### Notes on the sheet
- FDCAN
- CAN_H CAN_L to BackPanel
- Twin Quad SPI Flash
- Title:
- Project:
- Size:
- Date:
- A4
- Reference:
- Sheet:
- Revision:
- of

### Library data of the parts
C13 = Cap: Capacitor; Value: 10nF; Ordered by: Subcon; Published: 8-Jun-2000; Revision: July-2002: Re-released for DXP Platform.; Publisher: Altium Limited
C99 C100 = Cap: Capacitor; Value: 10nF; Published: 8-Jun-2000; Revision: July-2002: Re-released for DXP Platform.; Publisher: Altium Limited
D2 = ESDCAN02-2BWY: TVS Diode (Bi-directional); Manufacturer_Name: STMicroelectronics; Datasheet Link: https://www.st.com/resource/en/datasheet/esdcan02-2bwy.pdf; Height: 1.1mm; Manufacturer_Part_Number: ESDCAN02-2BWY; Mouser Part Number: 511-ESDCAN02-2BWY; Mouser Price/Stock: https://www.mouser.co.uk/ProductDetail/STMicroelectronics/ESDCAN02-2BWY?qs=FqY30PPN9V14rBXzBYhRkA%3D%3D; Arrow Part Number: ESDCAN02-2BWY; Arrow Price/Stock: https://www.arrow.com/en/products/esdcan02-2bwy/stmicroelectronics?region=nac
JP1 = JUMPER_SOLDER: JUMPER, HEADER 2PIN; MANF: MANF; MANF_P#: MANF_P#; VALUE: JMPSOLDER
R4#1 R26-R28 R32 R33 R36 R38 R52 = Res1: Resistor; Value: 1K; Published: 8-Jun-2000; Revision: July-2002: Re-released for DXP Platform.; Publisher: Altium Limited
R5#1 R55 R56 = res1: Resistor; Value: 1K; Published: 8-Jun-2000; Revision: July-2002: Re-released for DXP Platform.; Publisher: Altium Limited
R19 = res1: Resistor; Value: 1K; Ordered by: Subcon; Published: 8-Jun-2000; Revision: July-2002: Re-released for DXP Platform.; Publisher: Altium Limited
U6 = MT25TL01GHBA8ESF-0SIT: Serial NOR Flash Memory; ECCN_US/EU: 3A991
U11 = MCP2562FD-H_SN: Integrated Circuit; Manufacturer_Name: Microchip; Manufacturer_Part_Number: MCP2562FD-H/SN; Datasheet Link: http://www.microchip.com/mymicrochip/filehandler.aspx?ddocname=en568915; Height: 1.75mm; Mouser Part Number: 579-MCP2562FD-H/SN; Mouser Price/Stock: https://www.mouser.co.uk/ProductDetail/Microchip-Technology/MCP2562FD-H-SN?qs=YlpJWyuQ3POk3KZHoNA6vA%3D%3D; Arrow Part Number: MCP2562FD-H/SN; Arrow Price/Stock: https://www.arrow.com/en/products/mcp2562fd-hsn/microchip-technology?region=nac

## Sheet SD card.SchDoc: MICRO SD 3.0 Card
size A4; DocumentNumber: MB1246; Revision: B.1; SheetNumber: 12; SheetTotal: 17; Project: STM32H7xxI-EVAL
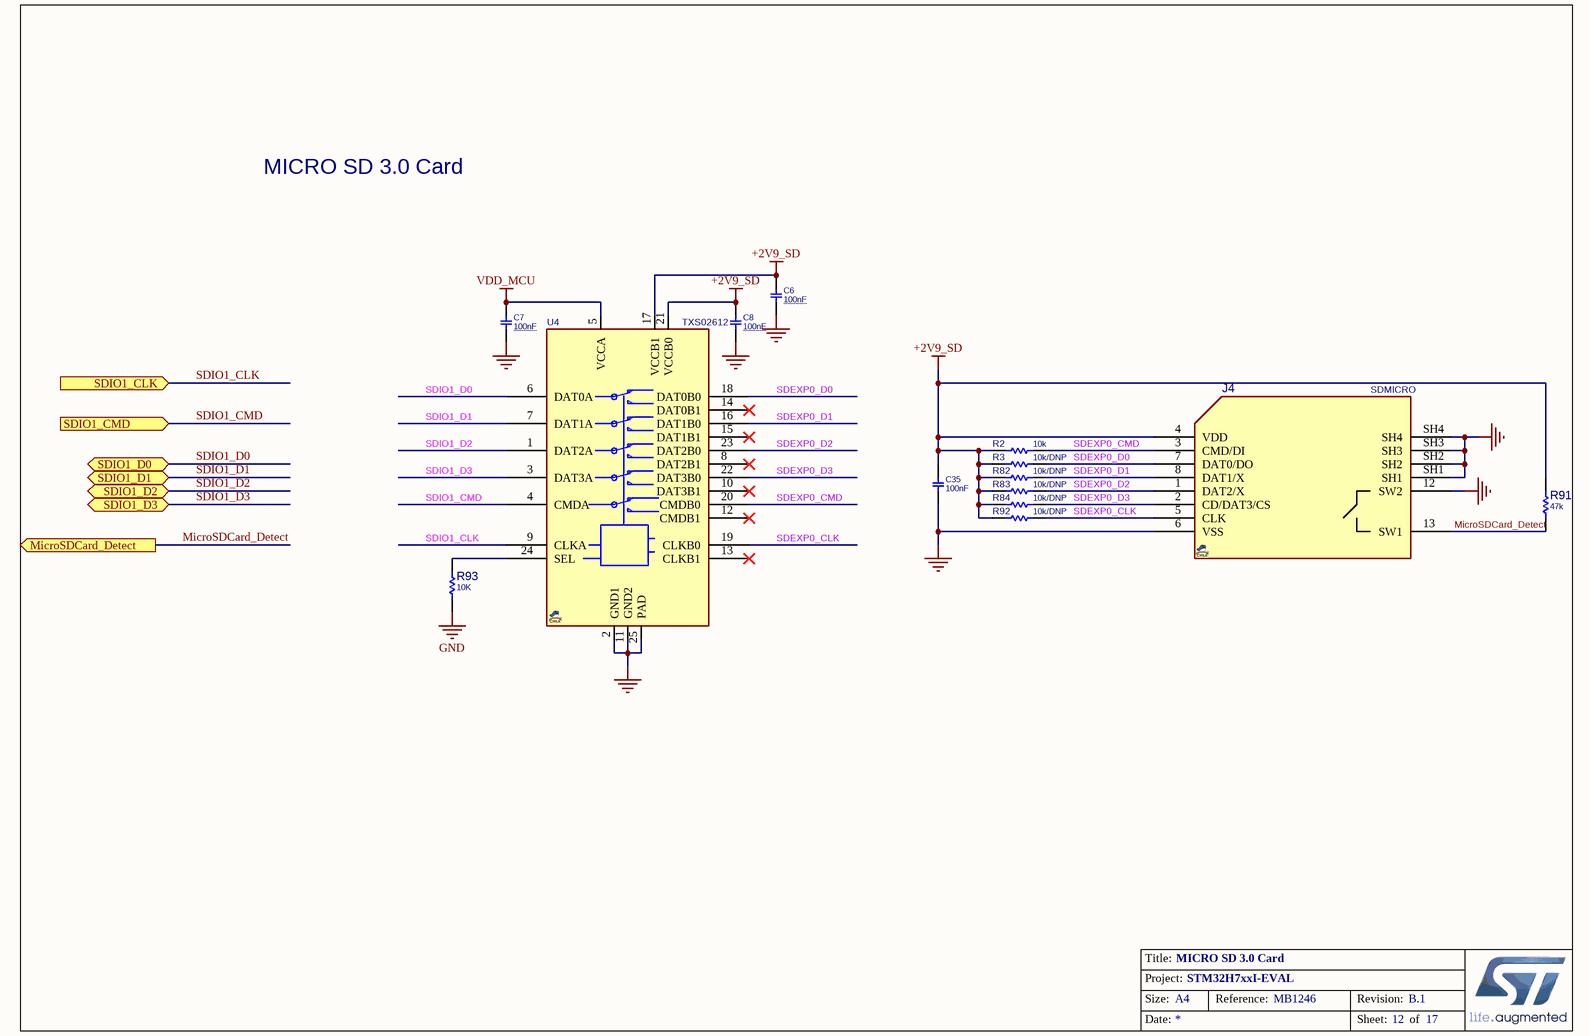
[diagram p7: SD card.SchDoc]

### Parts
(Parts that share a designator on the sheet are numbered #1, #2 ... from top to bottom, then left to right.)
C6#1  100nF  [C0603E]
C7#1  100nF  [C0603E]
C8#1  100nF  [C0603E]
C35  100nF  [C0603E]
J4  SDMICRO  [SDMICRO_MOLEX104031]
R2#1  10k  [R0603E]
R3#1  10k/DNP  [R0603E]
R82  10k/DNP  [R0603E]
R83  10k/DNP  [R0603E]
R84  10k/DNP  [R0603E]
R91  47k  [R0603E]
R92  10k/DNP  [R0603E]
R93  10K  [R0603E]
U4  TXS02612  [QFN50_24T]

### Ports
MicroSDCard_Detect (out), SDIO1_CLK (in), SDIO1_CMD (in), SDIO1_D0 (bidir), SDIO1_D1 (bidir), SDIO1_D2 (bidir), SDIO1_D3 (bidir)

### Nets
+2V9_SD: C6#1.1 C8#1.1 C35.1 J4.4(VDD) R2#1.1 R3#1.1 R82.1 R83.1 R84.1 R91.2 R92.1 U4.17(VCCB1) U4.21(VCCB0)
GND: C6#1.2 C7#1.2 C8#1.2 C35.2 J4.6(VSS) J4.12(SW2) J4.SH1 J4.SH2 J4.SH3 J4.SH4 R93.1 U4.2(GND1) U4.11(GND2) U4.25(PAD)
VDD_MCU: C7#1.1 U4.5(VCCA)
MicroSDCard_Detect: J4.13(SW1) R91.1 ; port MicroSDCard_Detect
SDEXP0_CLK: J4.5(CLK) R92.2 U4.19(CLKB0)
SDEXP0_CMD: J4.3(CMD/DI) R2#1.2 U4.20(CMDB0)
SDEXP0_D0: J4.7(DAT0/DO) R3#1.2 U4.18(DAT0B0)
SDEXP0_D1: J4.8(DAT1/X) R82.2 U4.16(DAT1B0)
SDEXP0_D2: J4.1(DAT2/X) R83.2 U4.23(DAT2B0)
SDEXP0_D3: J4.2(CD/DAT3/CS) R84.2 U4.22(DAT3B0)
SDIO1_CLK: U4.9(CLKA) ; port SDIO1_CLK
SDIO1_CMD: U4.4(CMDA) ; port SDIO1_CMD
SDIO1_D0: U4.6(DAT0A) ; port SDIO1_D0
SDIO1_D1: U4.7(DAT1A) ; port SDIO1_D1
SDIO1_D2: U4.1(DAT2A) ; port SDIO1_D2
SDIO1_D3: U4.3(DAT3A) ; port SDIO1_D3
NetR93_2: R93.2 U4.24(SEL)

Not connected (* = marked no-connect by the designer): U4 8(DAT2B1)* 10(DAT3B1)* 12(CMDB1)* 13(CLKB1)* 14(DAT0B1)* 15(DAT1B1)*

### Notes on the sheet
- MICRO SD 3.0 Card
- Title:
- Project:
- Size:
- Date:
- A4
- Reference:
- Sheet:
- Revision:
- of

### Library data of the parts
C6#1 C7#1 C8#1 = CAP_SMD_MLCC: CAP, MLCC; DESC: CAP, MLCC, 1nF, 50V, C0G, 10%, 0402; MANF_P#: MANF_PART#; MANF: Murata; PARAM2: 50V; PARAM: -; PRICE: 100= 1$; ASSEMBLY: ASSEMBLY; VALUE: 100nF
C35 = CAP_SMD_MLCC_100n50TDK: CAP, MLCC; PARAM: X5R, 10%; MANF_P#: GRM155R61E104; MANF: Murata; PARAM2: 25v; ASSEMBLY: ASSEMBLY; PRICE: 10,000:$0.006; VALUE: 100nF
J4 = SOCKET_SDMICRO_MOLEX104031: CONN MICRO SD R/A PUSHin-PULLout SMD; MANF: Molex; MANF_P#: 104031-0811; PRICE: 2$; VALUE: SDMICRO
R2#1 R3#1 R82-R84 R91-R93 = RES_SMD: RESISTOR, SMD; PARAM: 0.063W; DESC: DESCRIPTION; DIST#: MOUSER; PARAM2: 1%; MANF_P#: -; MANF: -; ASSEMBLY: ASSEMBLY; PRICE: 100= 0.3$
  R2#1: VALUE: 10k
  R3#1 R82-R84 R92: VALUE: 10k/DNP
  R91: VALUE: 47k
  R93: VALUE: 10K
U4 = TXS02612_QFN24: I/O Expander, SDIO; MANF: Texas Instruments; MANF_P#: TXS02612RTWR; PARAM2: 1.1~3.6V; VALUE: TXS02612